# EAGLE design Keyboard (EAGLE 7.2.0)
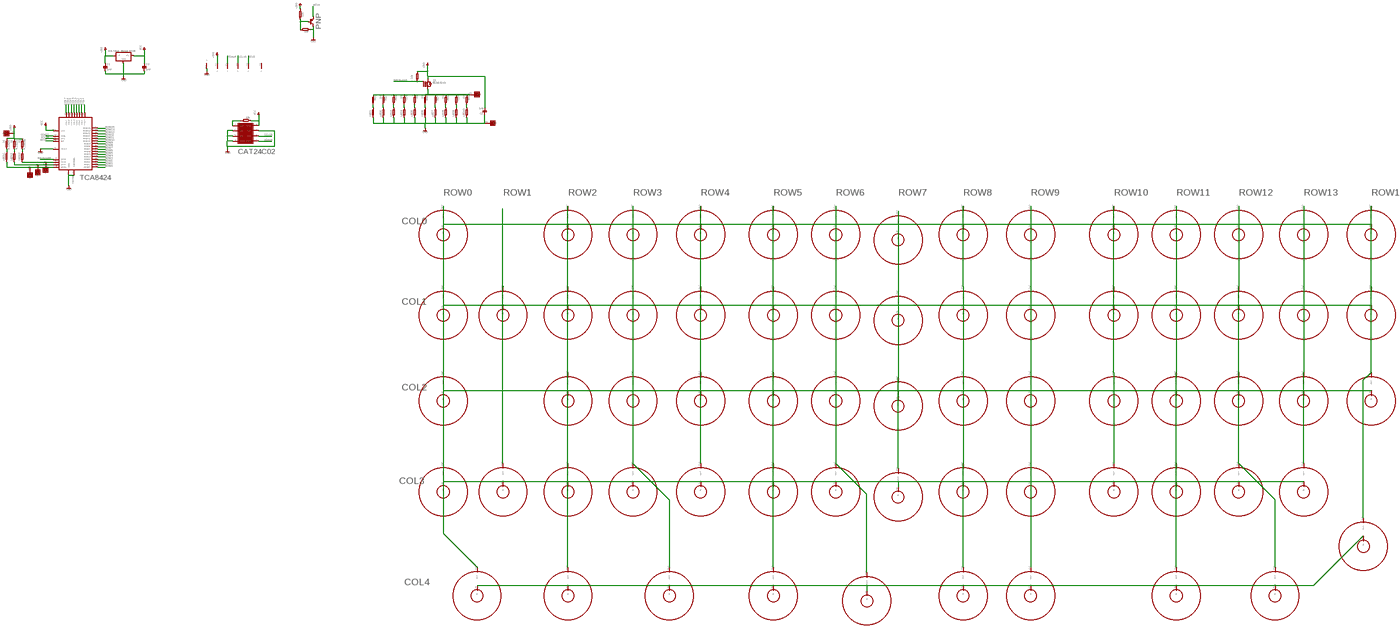
[diagram p0: schematic, sheet 1, overview]
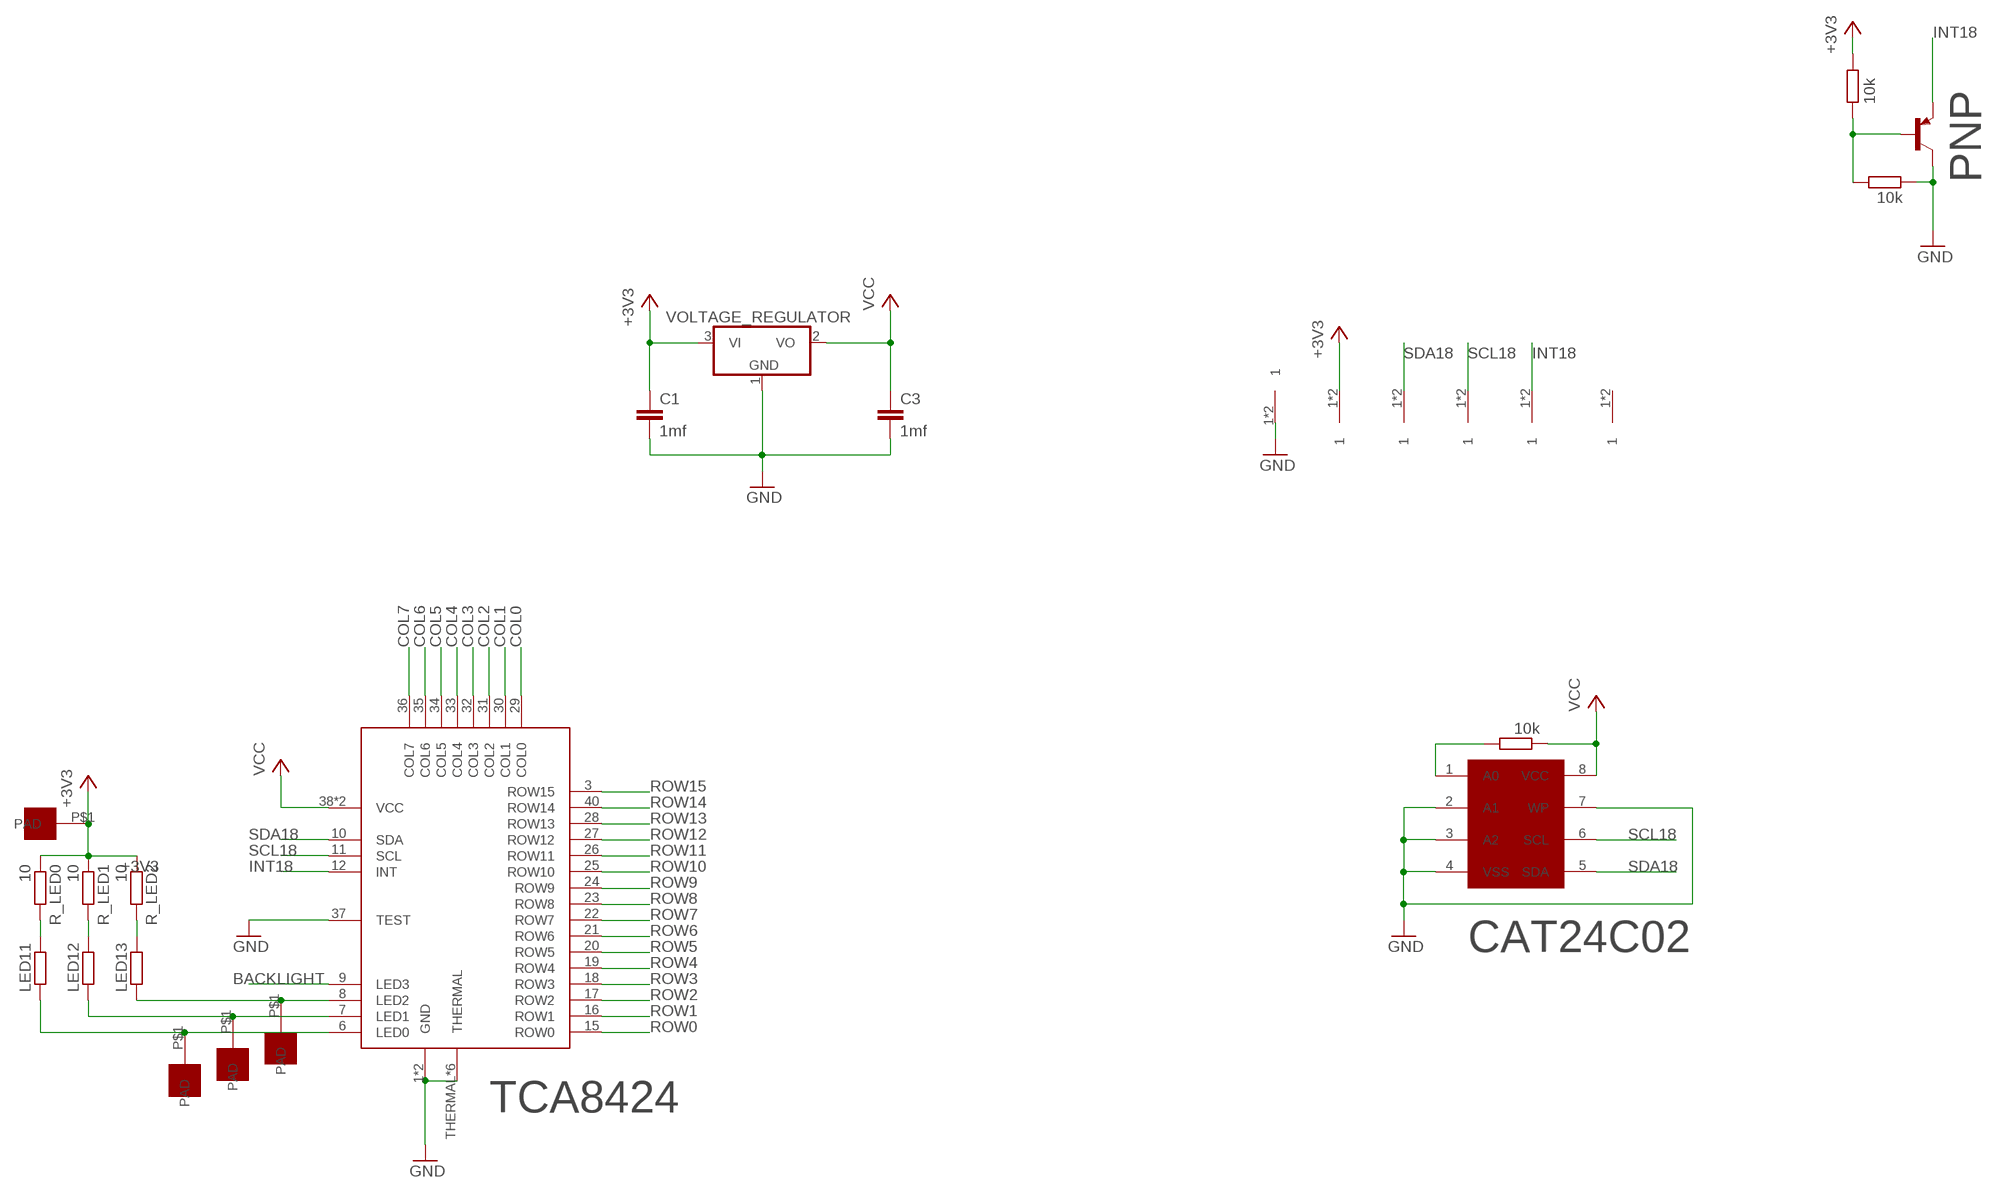
[diagram p1: schematic, sheet 1, part 1 of 5]
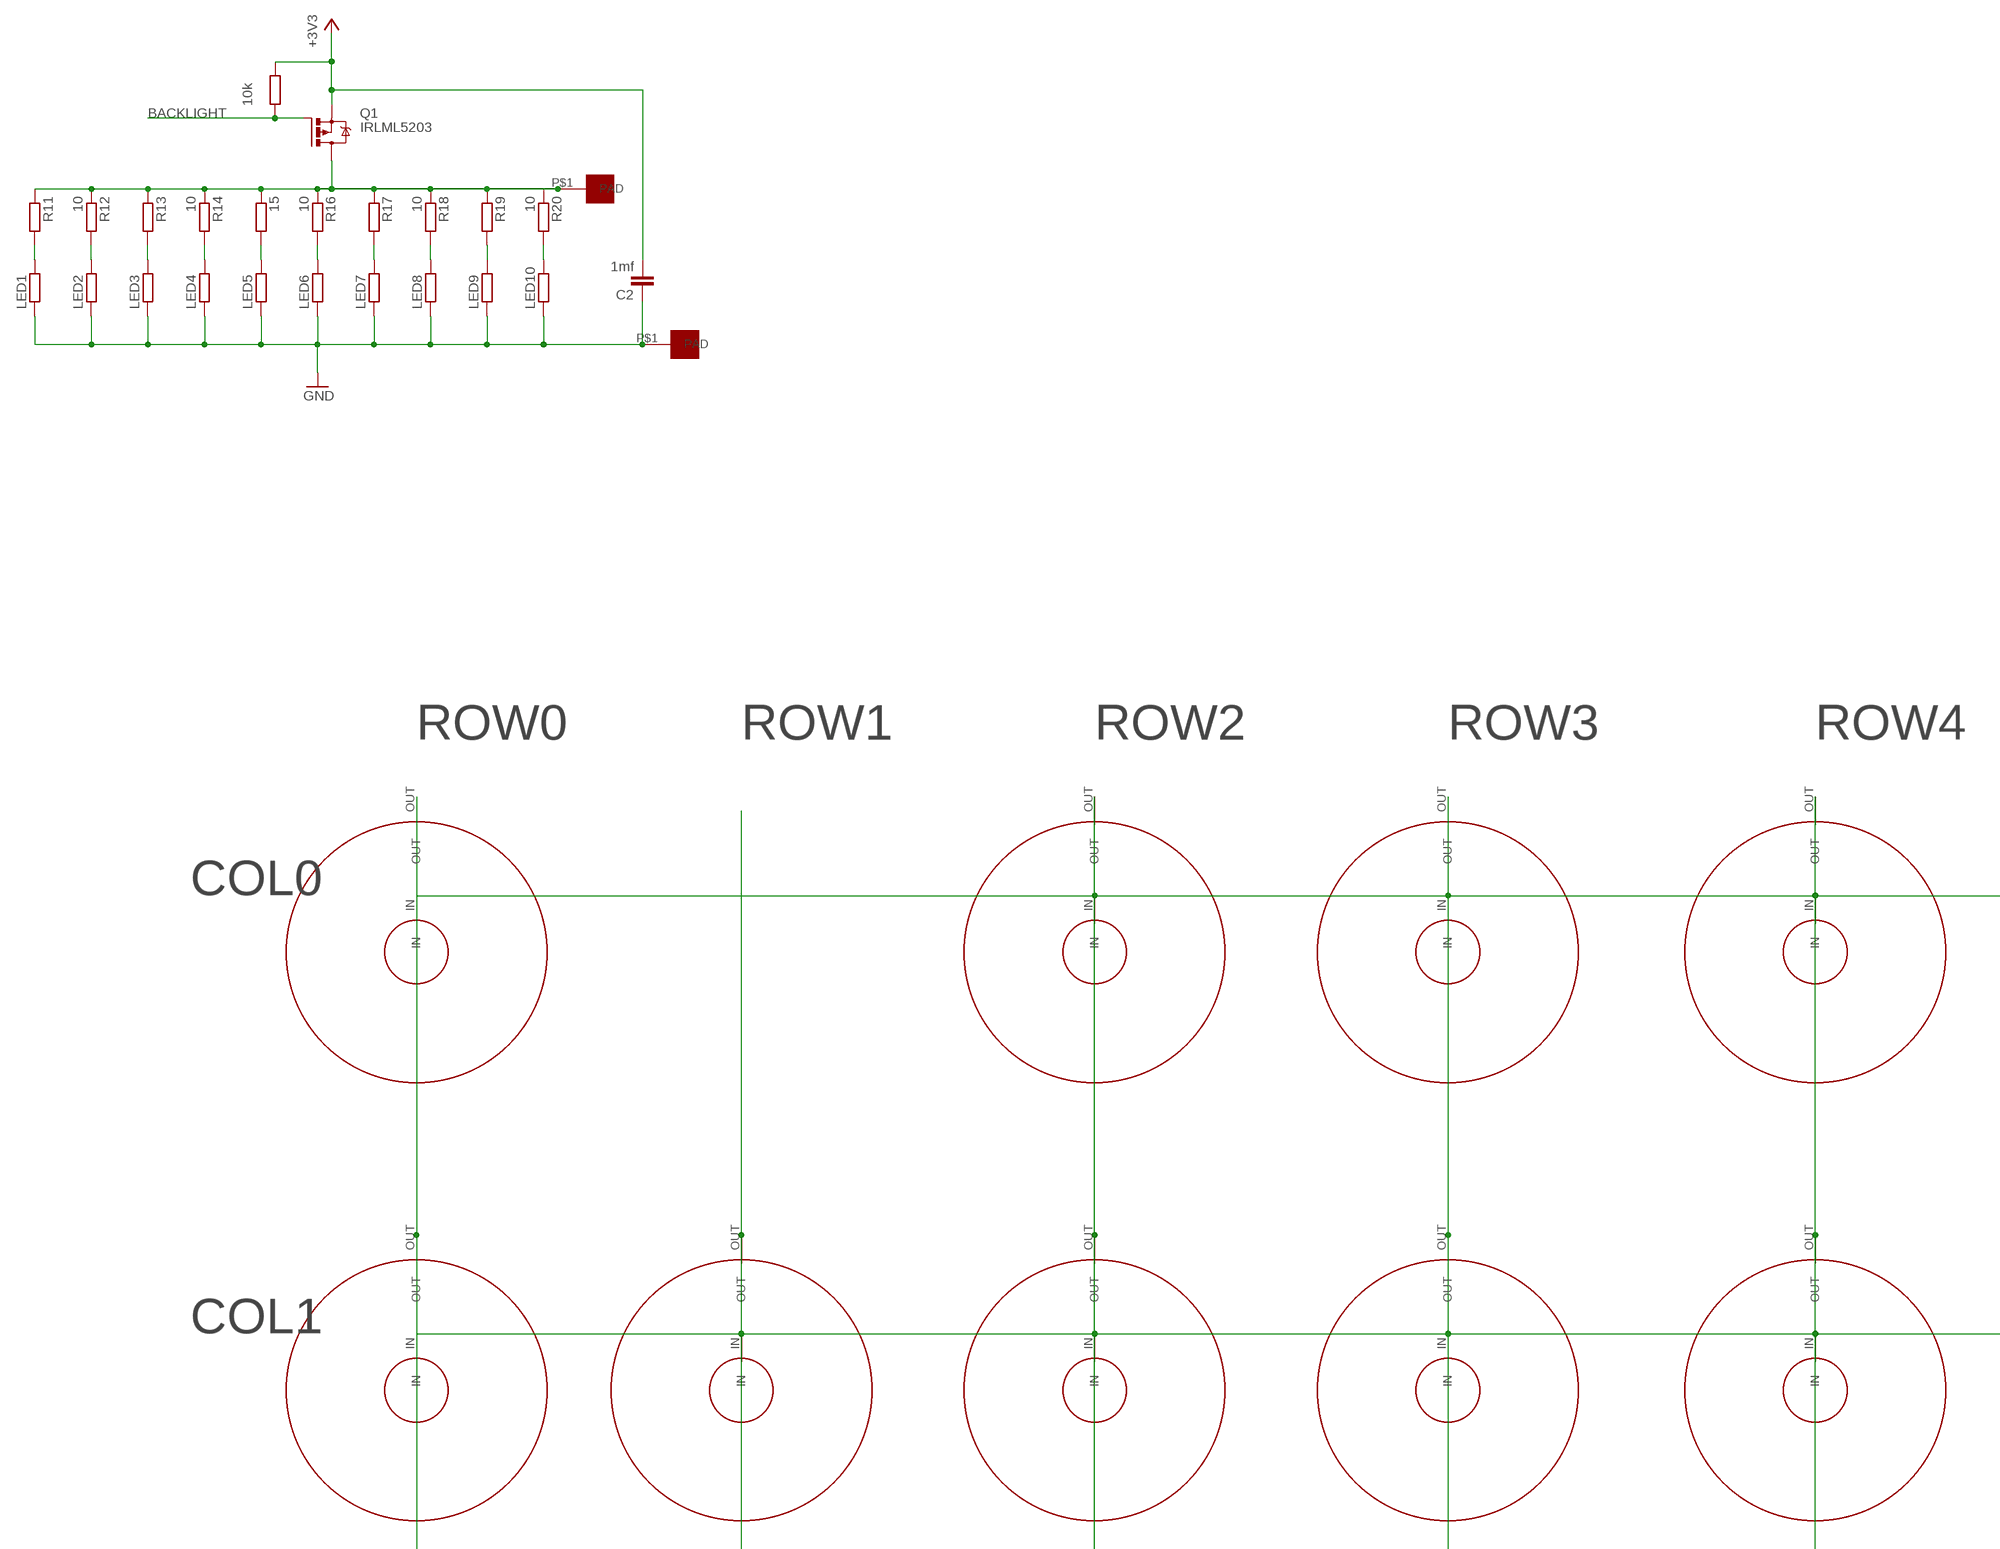
[diagram p2: schematic, sheet 1, part 2 of 5]
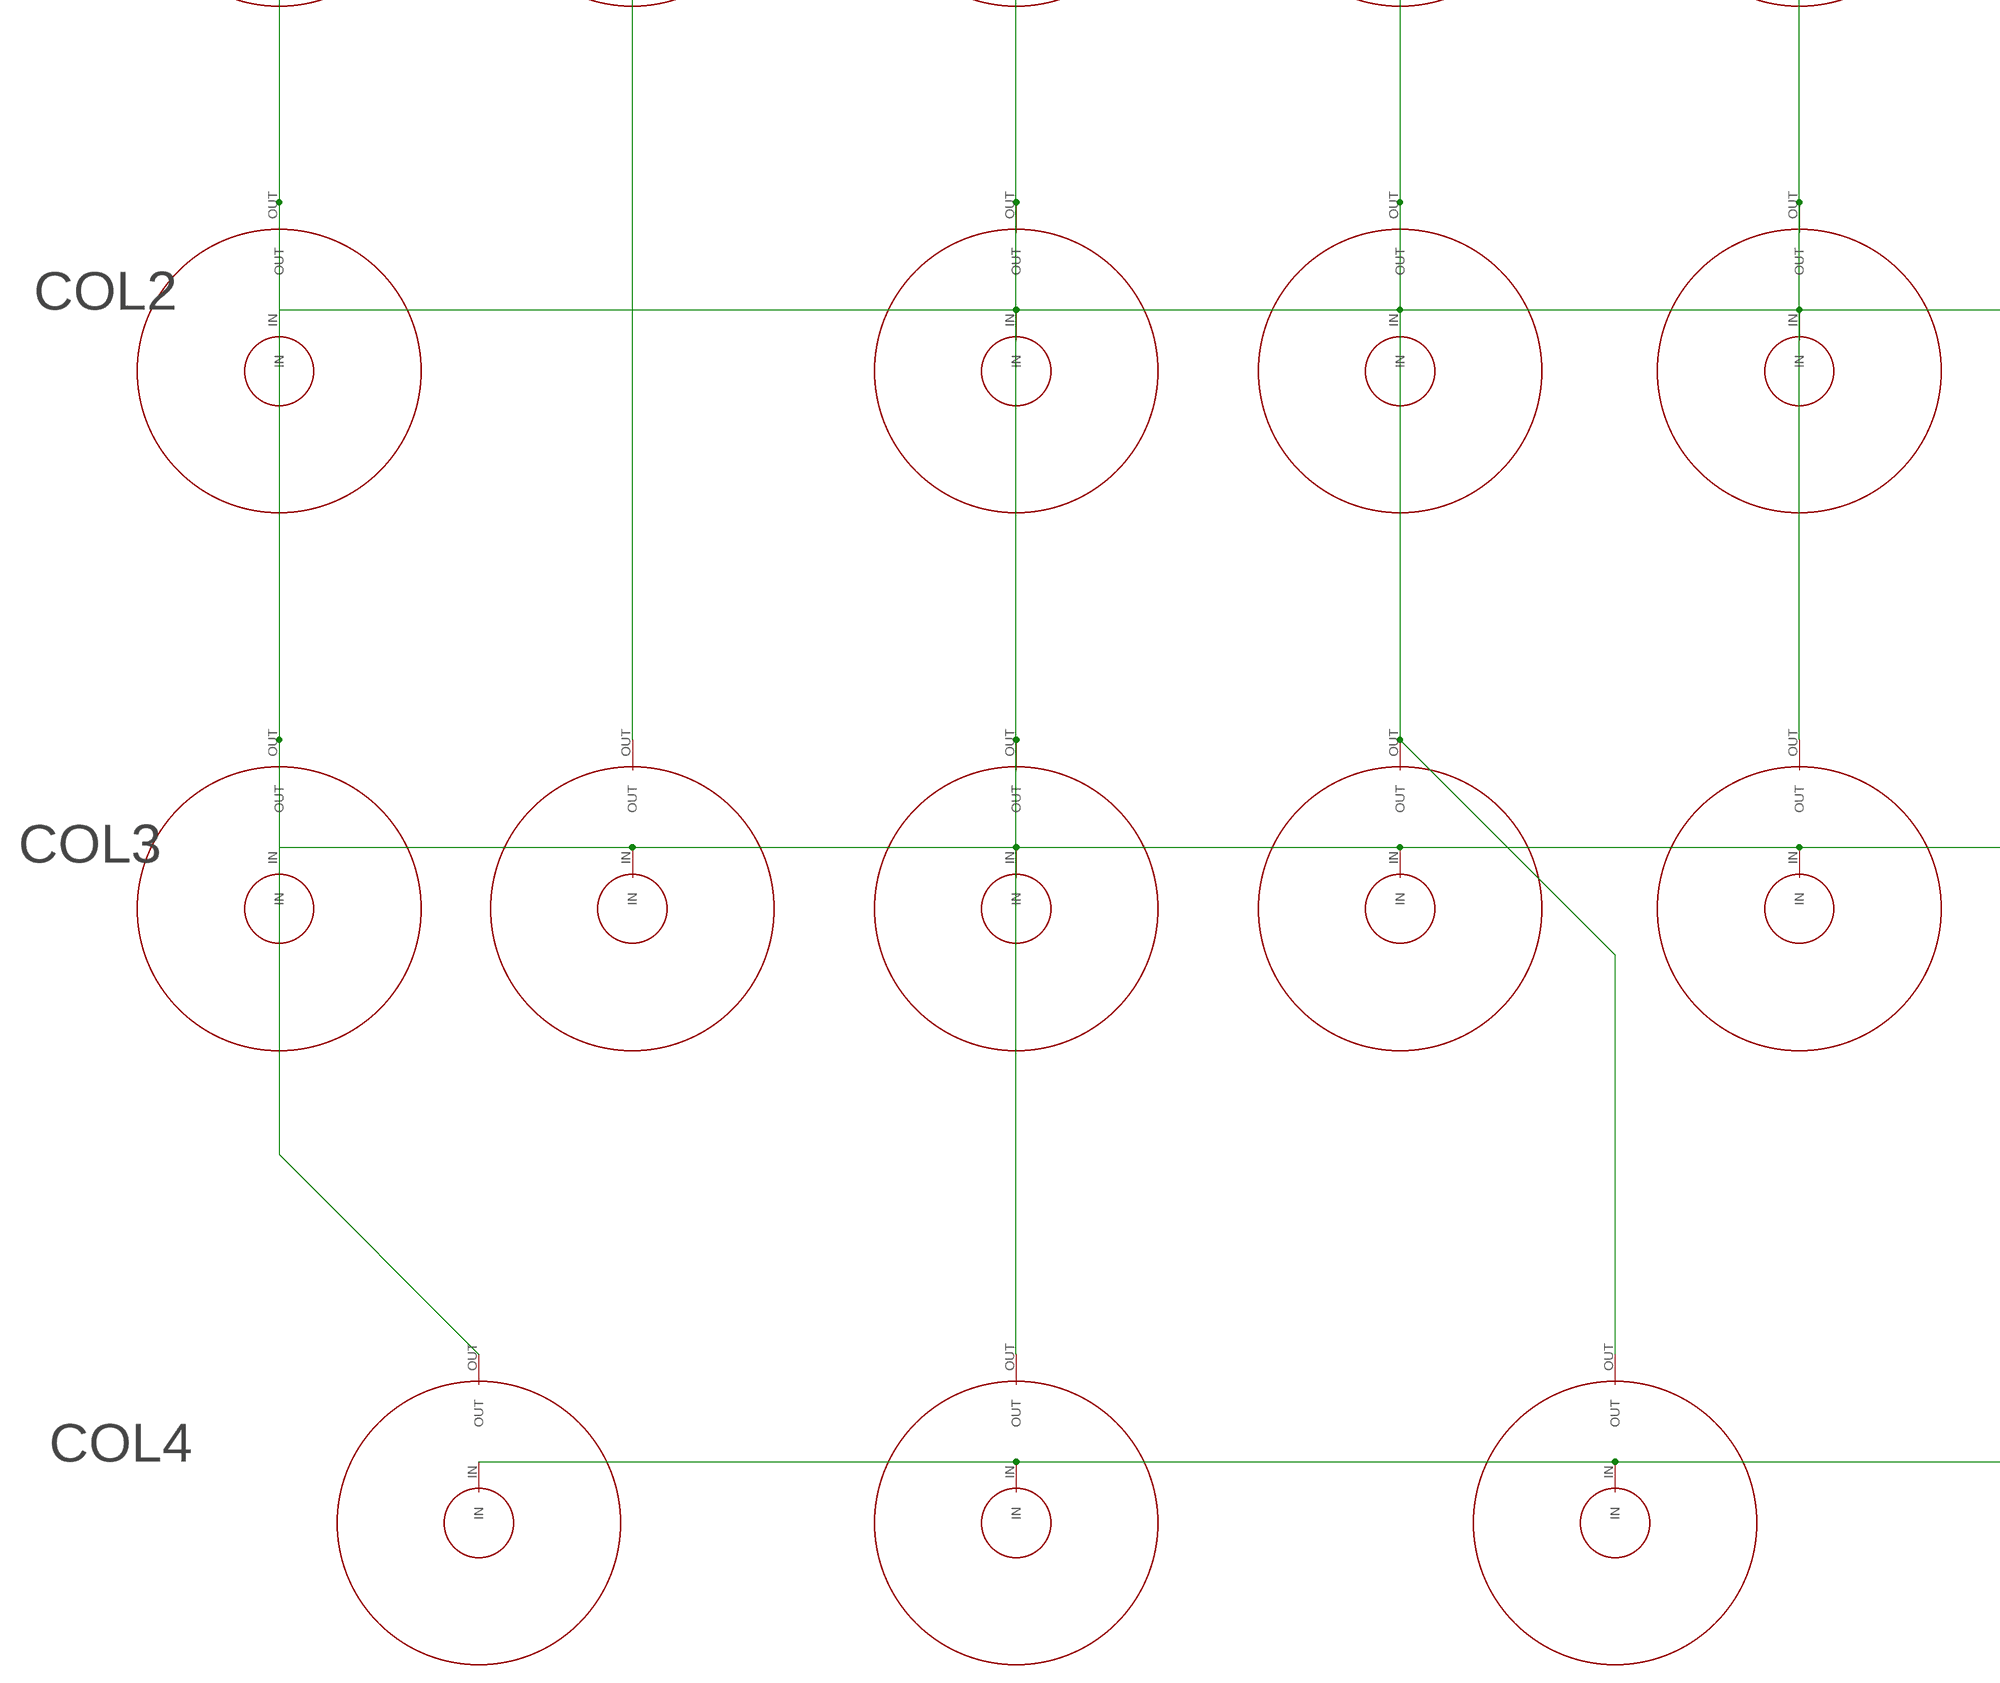
[diagram p3: schematic, sheet 1, part 3 of 5]
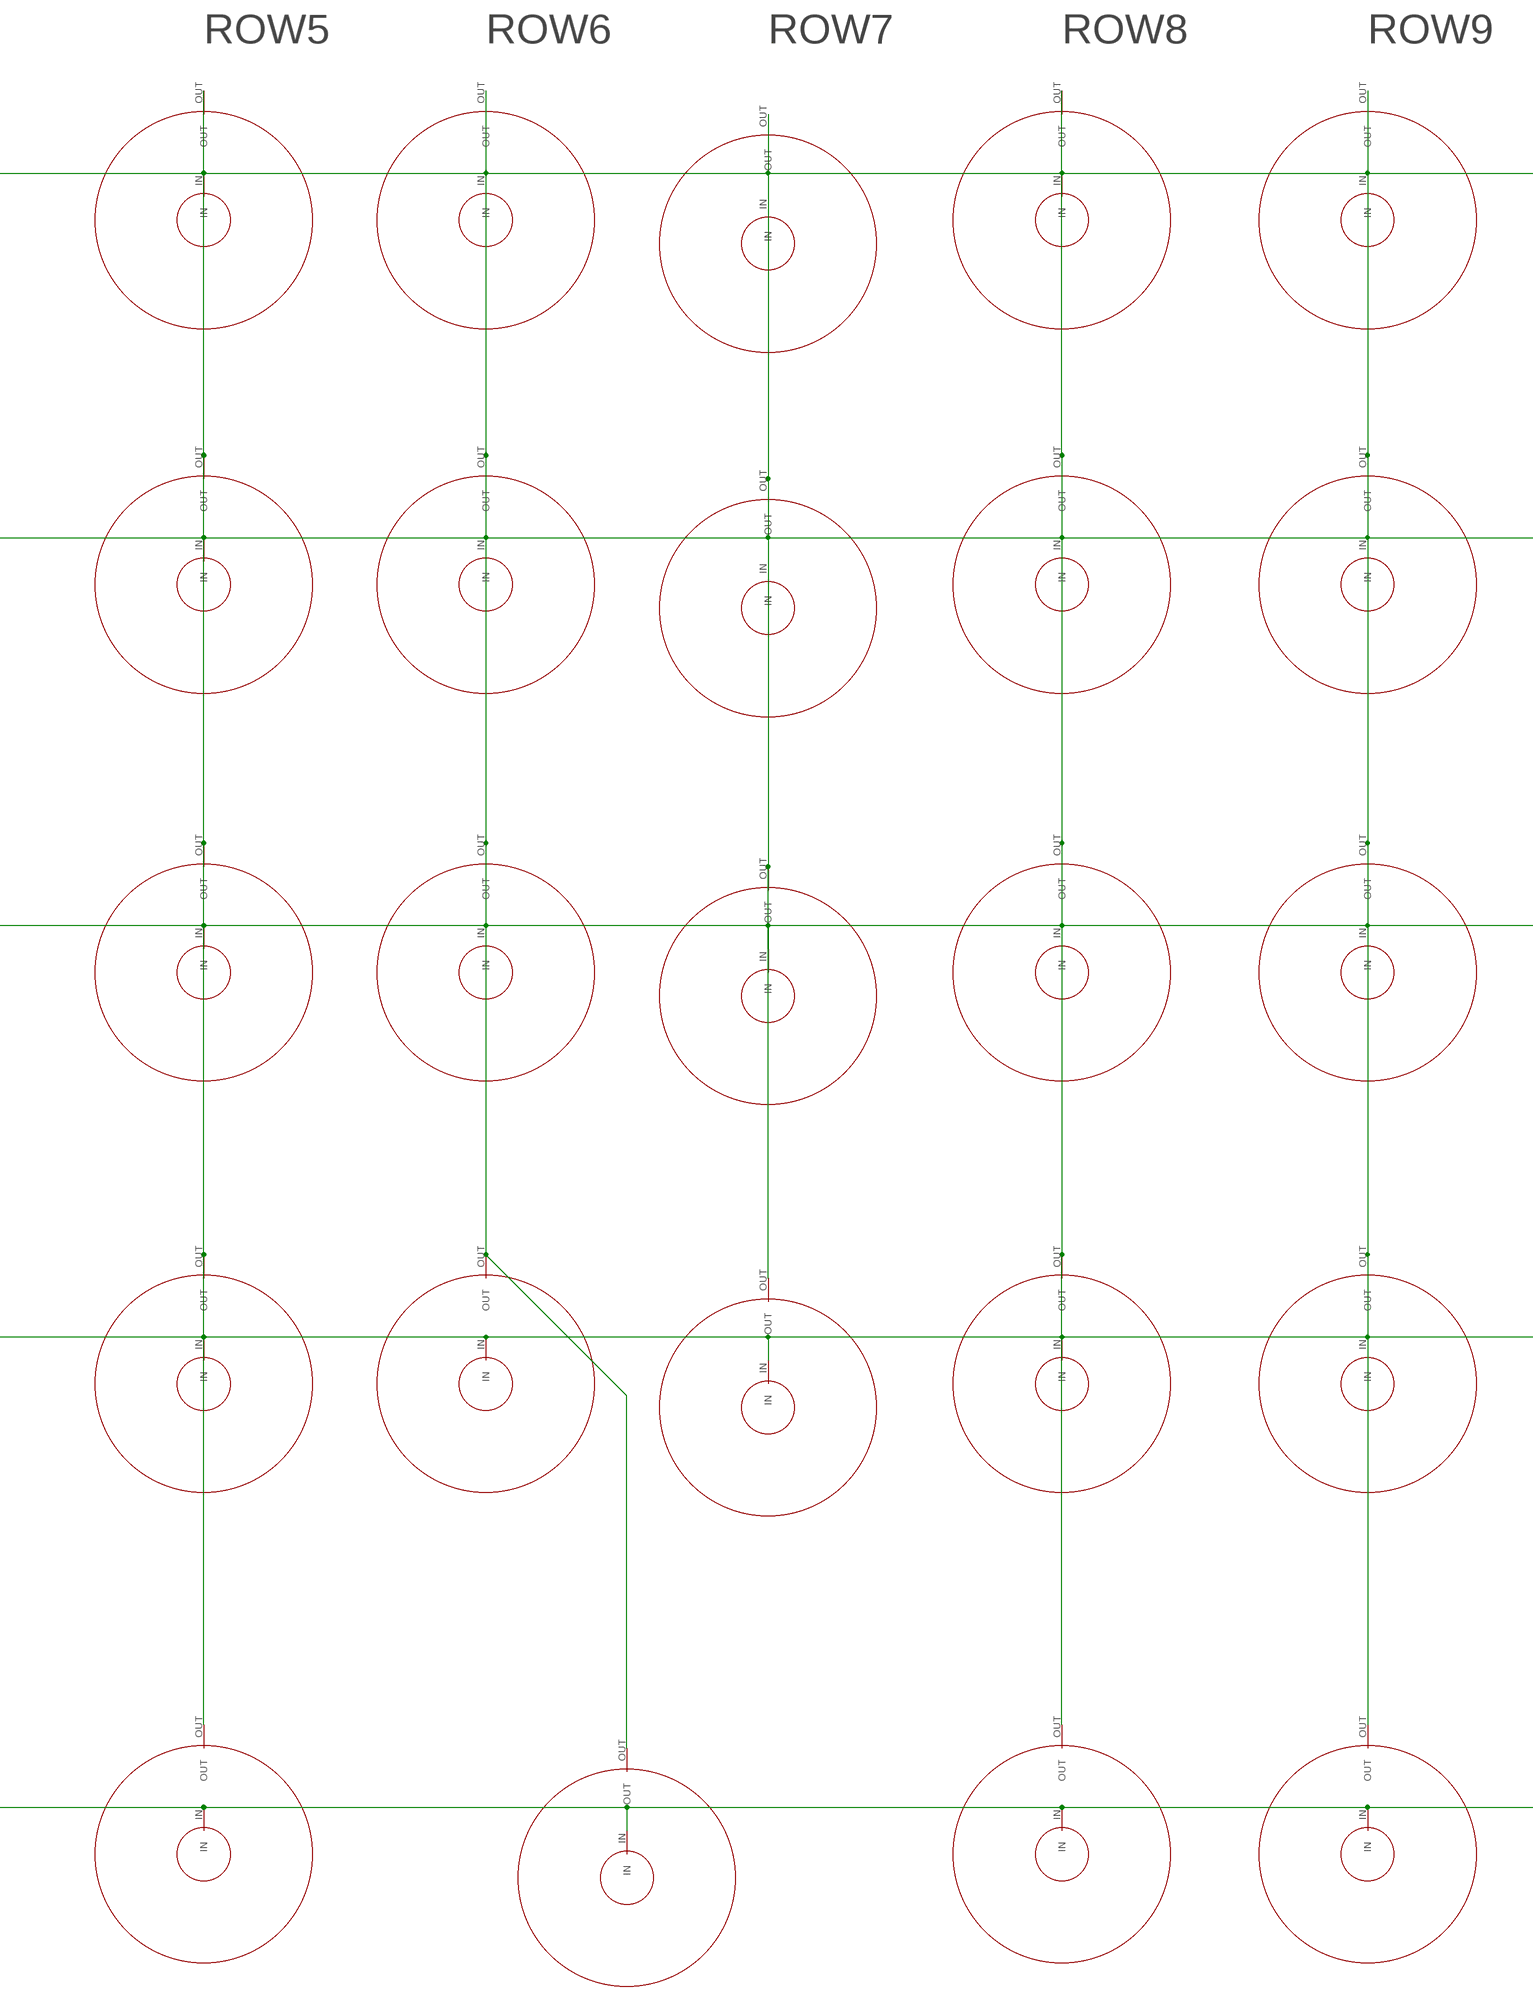
[diagram p4: schematic, sheet 1, part 4 of 5]
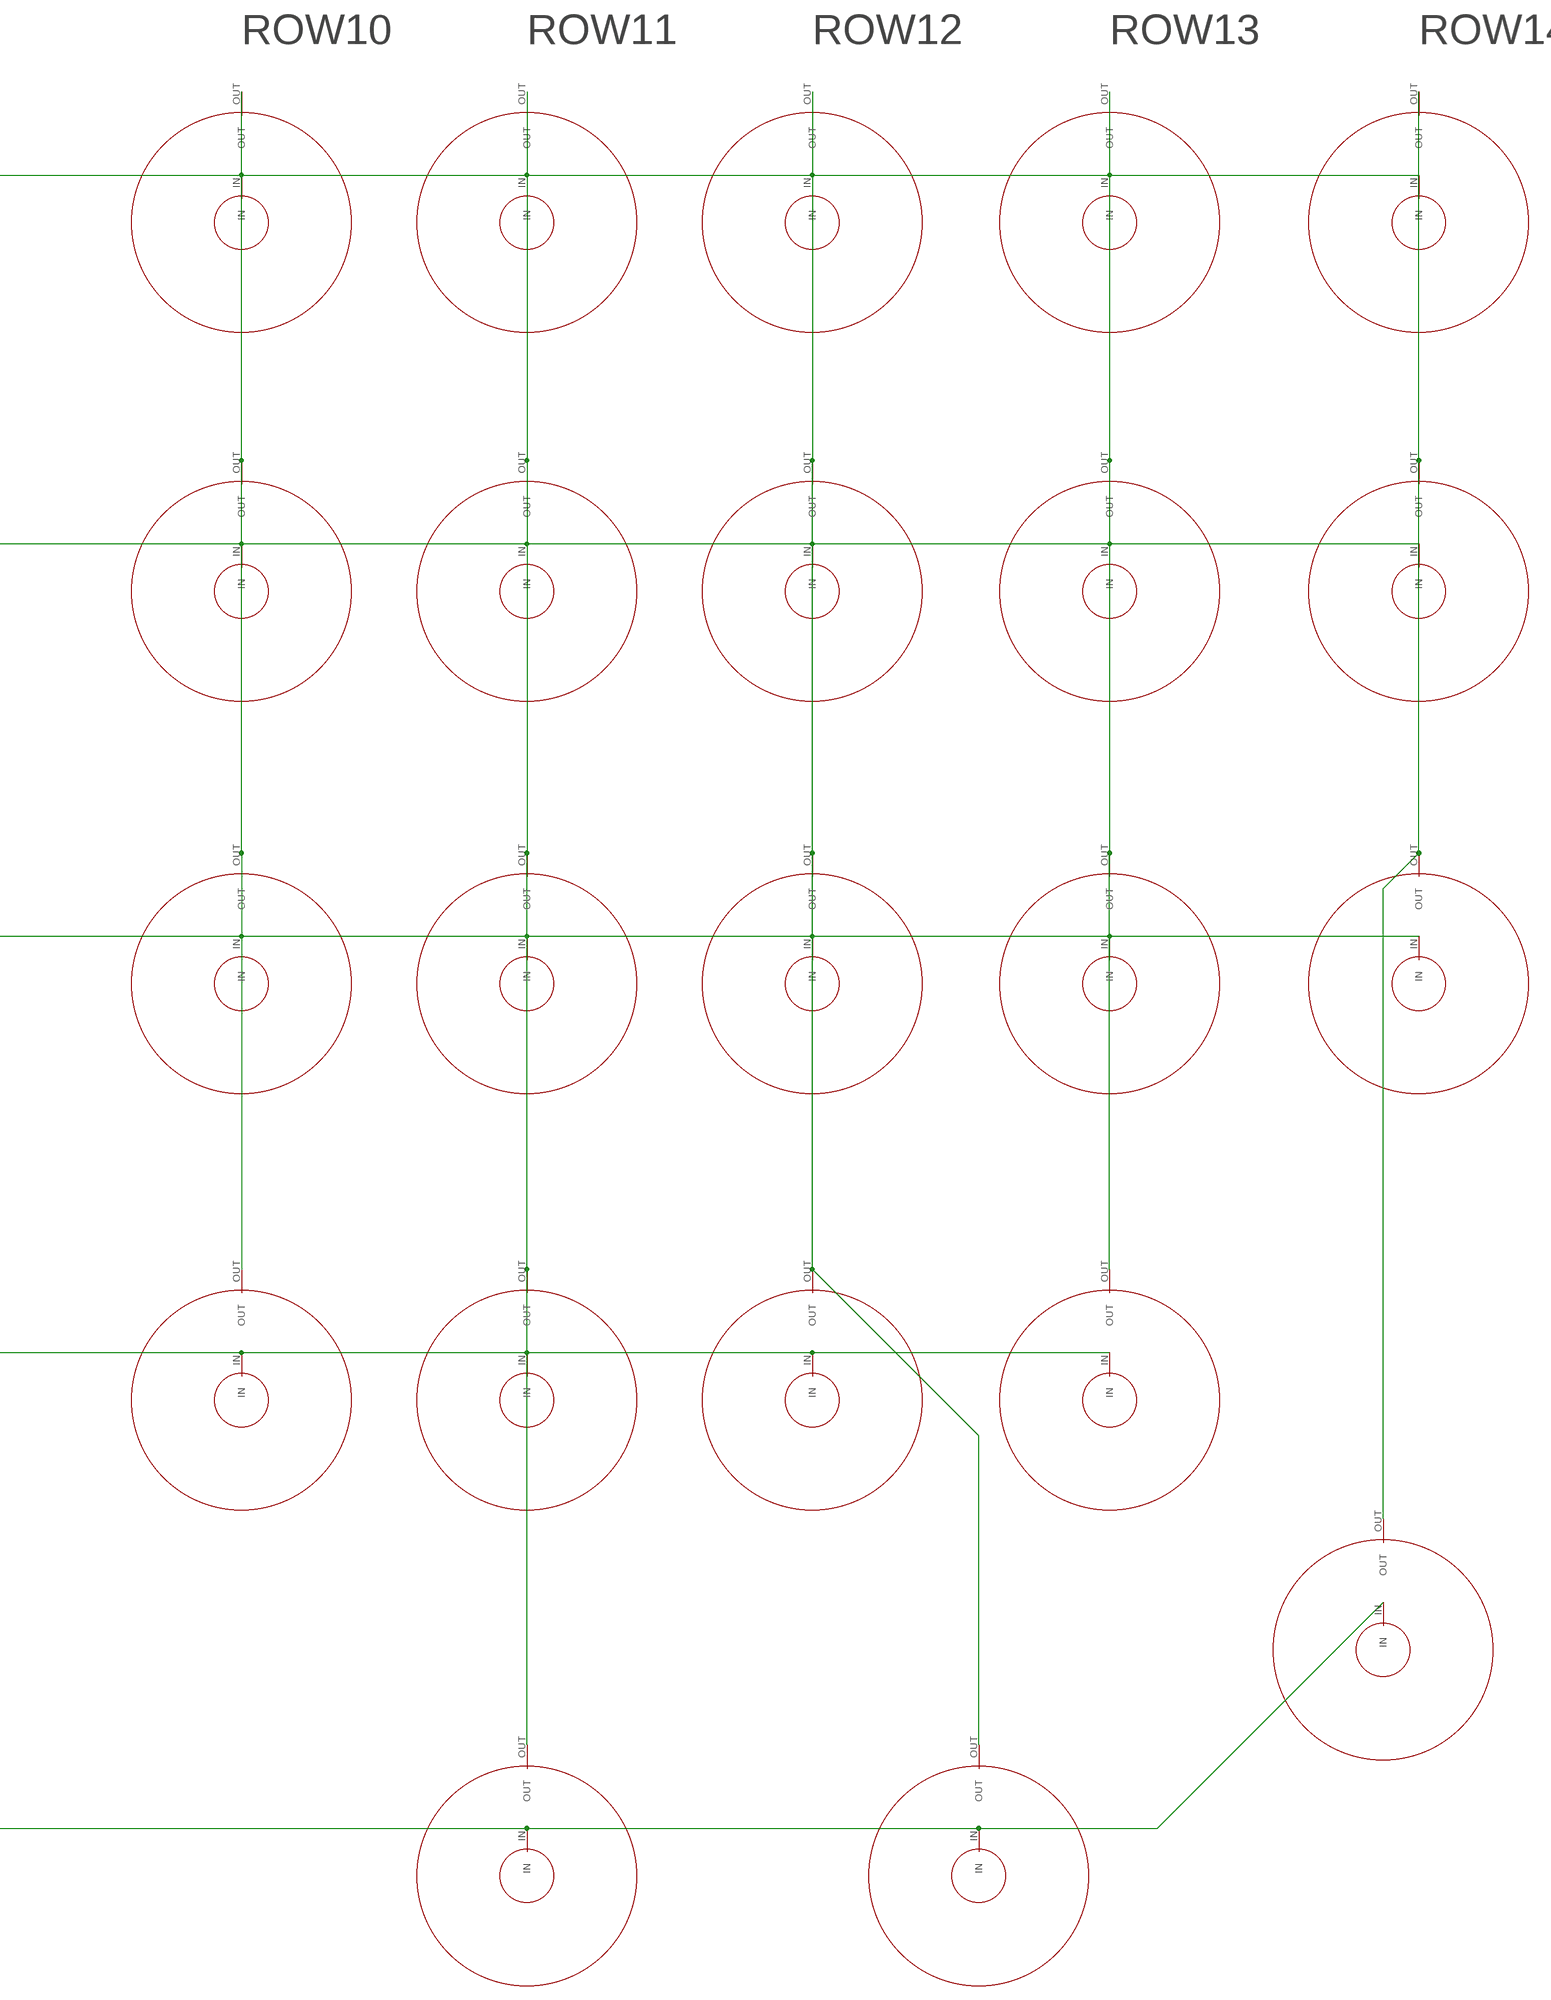
[diagram p5: schematic, sheet 1, part 5 of 5]

## Parts
15  R-EU_R0603  [R0603]
+  PAD  [PAD]
BL_PULLUP  10k  R-EU_R0603  [R0603]
C1  1mf  C-EUC0603  [C0603]
C2  1mf  C-EUC0603  [C0603]
C3  1mf  C-EUC0603  [C0603]
LED1  R-EU_R0402  [R0402]
LED2  R-EU_R0402  [R0402]
LED3  R-EU_R0402  [R0402]
LED4  R-EU_R0402  [R0402]
LED5  R-EU_R0402  [R0402]
LED6  R-EU_R0402  [R0402]
LED7  R-EU_R0402  [R0402]
LED8  R-EU_R0402  [R0402]
LED9  R-EU_R0402  [R0402]
LED10  R-EU_R0402  [R0402]
LED11  R-EU_R0402  [R0402]
LED12  R-EU_R0402  [R0402]
LED13  R-EU_R0402  [R0402]
PNP_DOWN  10k  R-EU_R0603  [R0603]
PNP_DOWN1  10k  R-EU_R0603  [R0603]
PNP_UP  10k  R-EU_R0603  [R0603]
Q1  IRLML5203  [MICRO3]
Q2  MMBTA56-SOT23  [SOT23]
R11  R-EU_R0603  [R0603]
R12  10  R-EU_R0603  [R0603]
R13  R-EU_R0603  [R0603]
R14  10  R-EU_R0603  [R0603]
R16  10  R-EU_R0603  [R0603]
R17  R-EU_R0603  [R0603]
R18  10  R-EU_R0603  [R0603]
R19  R-EU_R0603  [R0603]
R20  10  R-EU_R0603  [R0603]
R_LED0  10  R-EU_R0603  [R0603]
R_LED1  10  R-EU_R0603  [R0603]
R_LED2  10  R-EU_R0603  [R0603]
U$1  CAT24  [CAT24]
U$2  TCA8424  [QFN40]
U$3  BOTTOM_POGO  [POGO]
U$4  BOTTOM_POGO  [POGO]
U$5  BOTTOM_POGO  [POGO]
U$6  BOTTOM_POGO  [POGO]
U$7  BOTTOM_POGO  [POGO]
U$8  BOTTOM_POGO  [POGO]
U$9  DOME  [4MM]
U$11  DOME  [4MM]
U$12  DOME  [4MM]
U$13  DOME  [4MM]
U$14  DOME  [4MM]
U$15  DOME  [4MM]
U$16  DOME  [4MM]
U$17  DOME  [4MM]
U$18  DOME  [4MM]
U$19  DOME  [4MM]
U$20  DOME  [4MM]
U$21  DOME  [4MM]
U$22  DOME  [4MM]
U$23  DOME  [4MM]
U$24  DOME  [4MM]
U$25  DOME  [4MM]
U$26  DOME  [4MM]
U$27  DOME  [4MM]
U$28  DOME  [4MM]
U$29  DOME  [4MM]
U$30  DOME  [4MM]
U$31  DOME  [4MM]
U$32  DOME  [4MM]
U$33  DOME  [4MM]
U$34  DOME  [4MM]
U$35  DOME  [4MM]
U$36  DOME  [4MM]
U$37  DOME  [4MM]
U$38  DOME  [4MM]
U$39  DOME  [4MM]
U$40  DOME  [4MM]
U$41  DOME  [4MM]
U$42  DOME  [4MM]
U$43  DOME  [4MM]
U$44  DOME  [4MM]
U$45  DOME  [4MM]
U$46  DOME  [4MM]
U$47  DOME  [4MM]
U$48  DOME  [4MM]
U$49  DOME  [4MM]
U$50  DOME  [4MM]
U$51  DOME  [4MM]
U$52  DOME  [4MM]
U$53  PAD  [PAD]
U$54  DOME  [4MM]
U$55  DOME  [4MM]
U$56  DOME  [4MM]
U$57  DOME  [4MM]
U$58  DOME  [4MM]
U$59  DOME  [4MM]
U$60  DOME  [4MM]
U$61  DOME  [4MM]
U$62  DOME  [4MM]
U$63  DOME  [4MM]
U$64  DOME  [4MM]
U$65  DOME  [4MM]
U$66  DOME  [4MM]
U$67  DOME  [4MM]
U$68  DOME  [4MM]
U$69  DOME  [4MM]
U$70  DOME  [4MM]
U$71  PAD  [PAD]
U$72  DOME  [4MM]
U$73  DOME  [4MM]
U$74  PAD  [PAD]
U$75  DOME  [4MM]
U$76  DOME  [4MM]
U$77  DOME  [4MM]
U$78  PAD  [PAD]
U$79  DOME  [4MM]
U$80  PAD  [PAD]
U$81  DOME  [4MM]
VOLTAGE_REGULATOR  MCP1703CB  [SOT23]

## Nets
+3V3: +.P$1(PAD) BL_PULLUP.1 C1.1 C2.2 PNP_UP.1 Q1.2(S) R_LED0.1 R_LED1.1 R_LED2.1 U$4.1 U$4.P$2 VOLTAGE_REGULATOR.3(VI)
BACKLIGHT: BL_PULLUP.2 Q1.1(G) U$2.9(LED3)
COL0: U$2.29(COL0) U$9.IN U$11.IN U$12.IN U$13.IN U$14.IN U$15.IN U$16.IN U$17.IN U$18.IN U$19.IN U$20.IN U$21.IN U$22.IN U$23.IN
COL1: U$2.30(COL1) U$24.IN U$25.IN U$26.IN U$27.IN U$28.IN U$29.IN U$30.IN U$31.IN U$32.IN U$33.IN U$34.IN U$35.IN U$36.IN U$37.IN U$38.IN
COL2: U$2.31(COL2) U$39.IN U$40.IN U$41.IN U$42.IN U$43.IN U$44.IN U$45.IN U$46.IN U$47.IN U$48.IN U$49.IN U$50.IN U$51.IN U$52.IN
COL3: U$2.32(COL3) U$54.IN U$55.IN U$56.IN U$57.IN U$58.IN U$59.IN U$60.IN U$61.IN U$62.IN U$63.IN U$64.IN U$65.IN U$66.IN U$68.IN
COL4: U$2.33(COL4) U$67.IN U$69.IN U$70.IN U$72.IN U$73.IN U$75.IN U$76.IN U$77.IN U$79.IN U$81.IN
COL5: U$2.34(COL5)
COL6: U$2.35(COL6)
COL7: U$2.36(COL7)
DRAIN: 15.1 Q1.3(D) R11.1 R12.1 R13.1 R14.1 R16.1 R17.1 R18.1 R19.1 R20.1 U$78.P$1(PAD)
GND: C1.2 C2.1 C3.2 LED1.1 LED2.1 LED3.1 LED4.1 LED5.1 LED6.1 LED7.1 LED8.1 LED9.1 LED10.1 PNP_DOWN.2 Q2.3(C) U$1.2(A1) U$1.3(A2) U$1.4(VSS) U$1.7(WP) U$2.1(GND) U$2.4(GND) U$2.37(TEST) U$2.THERMAL U$2.VIA1(THERMAL) U$2.VIA2(THERMAL) U$2.VIA3(THERMAL) U$2.VIA4(THERMAL) U$2.VIA5(THERMAL) U$3.1 U$3.P$2 U$80.P$1(PAD) VOLTAGE_REGULATOR.1(GND)
INT18: Q2.2(E) U$2.12(INT) U$7.1 U$7.P$2
LED_GROUND0: LED11.2 R_LED0.2
LED_GROUND1: LED12.2 R_LED1.2
LED_GROUND2: LED13.2 R_LED2.2
N$1: LED1.2 R11.2
N$2: LED2.2 R12.2
N$3: LED3.2 R13.2
N$4: LED4.2 R14.2
N$6: 15.2 LED5.2
N$7: LED6.2 R16.2
N$8: LED7.2 R17.2
N$9: LED8.2 R18.2
N$10: LED9.2 R19.2
N$11: LED10.2 R20.2
N$13: PNP_DOWN.1 PNP_UP.2 Q2.1(B)
N$14: LED12.1 U$2.7(LED1) U$71.P$1(PAD)
N$15: LED11.1 U$2.6(LED0) U$53.P$1(PAD)
N$16: LED13.1 U$2.8(LED2) U$74.P$1(PAD)
N$17: PNP_DOWN1.2 U$1.1(A0)
ROW0: U$2.15(ROW0) U$9.OUT U$24.OUT U$39.OUT U$54.OUT U$69.OUT
ROW1: U$2.16(ROW1) U$38.OUT U$68.OUT
ROW2: U$2.17(ROW2) U$11.OUT U$25.OUT U$40.OUT U$55.OUT U$70.OUT
ROW3: U$2.18(ROW3) U$12.OUT U$26.OUT U$41.OUT U$56.OUT U$72.OUT
ROW4: U$2.19(ROW4) U$13.OUT U$27.OUT U$42.OUT U$57.OUT
ROW5: U$2.20(ROW5) U$14.OUT U$28.OUT U$43.OUT U$58.OUT U$73.OUT
ROW6: U$2.21(ROW6) U$15.OUT U$29.OUT U$44.OUT U$59.OUT U$75.OUT
ROW7: U$2.22(ROW7) U$16.OUT U$30.OUT U$45.OUT U$60.OUT
ROW8: U$2.23(ROW8) U$17.OUT U$31.OUT U$46.OUT U$61.OUT U$76.OUT
ROW9: U$2.24(ROW9) U$18.OUT U$32.OUT U$47.OUT U$62.OUT U$77.OUT
ROW10: U$2.25(ROW10) U$19.OUT U$33.OUT U$48.OUT U$63.OUT
ROW11: U$2.26(ROW11) U$20.OUT U$34.OUT U$49.OUT U$64.OUT U$79.OUT
ROW12: U$2.27(ROW12) U$21.OUT U$35.OUT U$50.OUT U$65.OUT U$81.OUT
ROW13: U$2.28(ROW13) U$22.OUT U$36.OUT U$51.OUT U$66.OUT
ROW14: U$2.40(ROW14) U$23.OUT U$37.OUT U$52.OUT U$67.OUT
ROW15: U$2.3(ROW15)
SCL18: U$1.6(SCL) U$2.11(SCL) U$6.1 U$6.P$2
SDA18: U$1.5(SDA) U$2.10(SDA) U$5.1 U$5.P$2
VCC: C3.1 PNP_DOWN1.1 U$1.8(VCC) U$2.38(VCC) U$2.39(VCC) VOLTAGE_REGULATOR.2(VO)
Unconnected: U$8.1 U$8.P$2

## Notes on the sheet
- PNP
- CAT24C02
- TCA8424

## Library data of the parts
15 BL_PULLUP LED1-LED13 PNP_DOWN PNP_DOWN1 PNP_UP R11-R14 R16-R20 R_LED0 R_LED1 R_LED2 = rcl:R-EU_: RESISTOR, European symbol
+ U$53 U$71 U$74 U$78 U$80 = PAD:PAD
C1-C3 = rcl:C-EU: CAPACITOR, European symbol
Q1 = transistor-power:IRLML5203: HEXFET P-Channel Power MOSFET
Q2 = transistor-pnp:*-?: PNP Transistor
U$1 = cat24:CAT24
U$2 = TCA8424:TCA8424
U$3-U$8 = bottom_pogo:BOTTOM_POGO
U$9 U$11-U$52 U$54-U$70 U$72 U$73 U$75-U$77 U$79 U$81 = DOME:DOME
VOLTAGE_REGULATOR = linear:MCP1703: 250 mA, 16V, Low Quiescent Current LDO Regulator Source: http://ww1.microchip.com/downloads/en/DeviceDoc/22049b.pdf

## Board
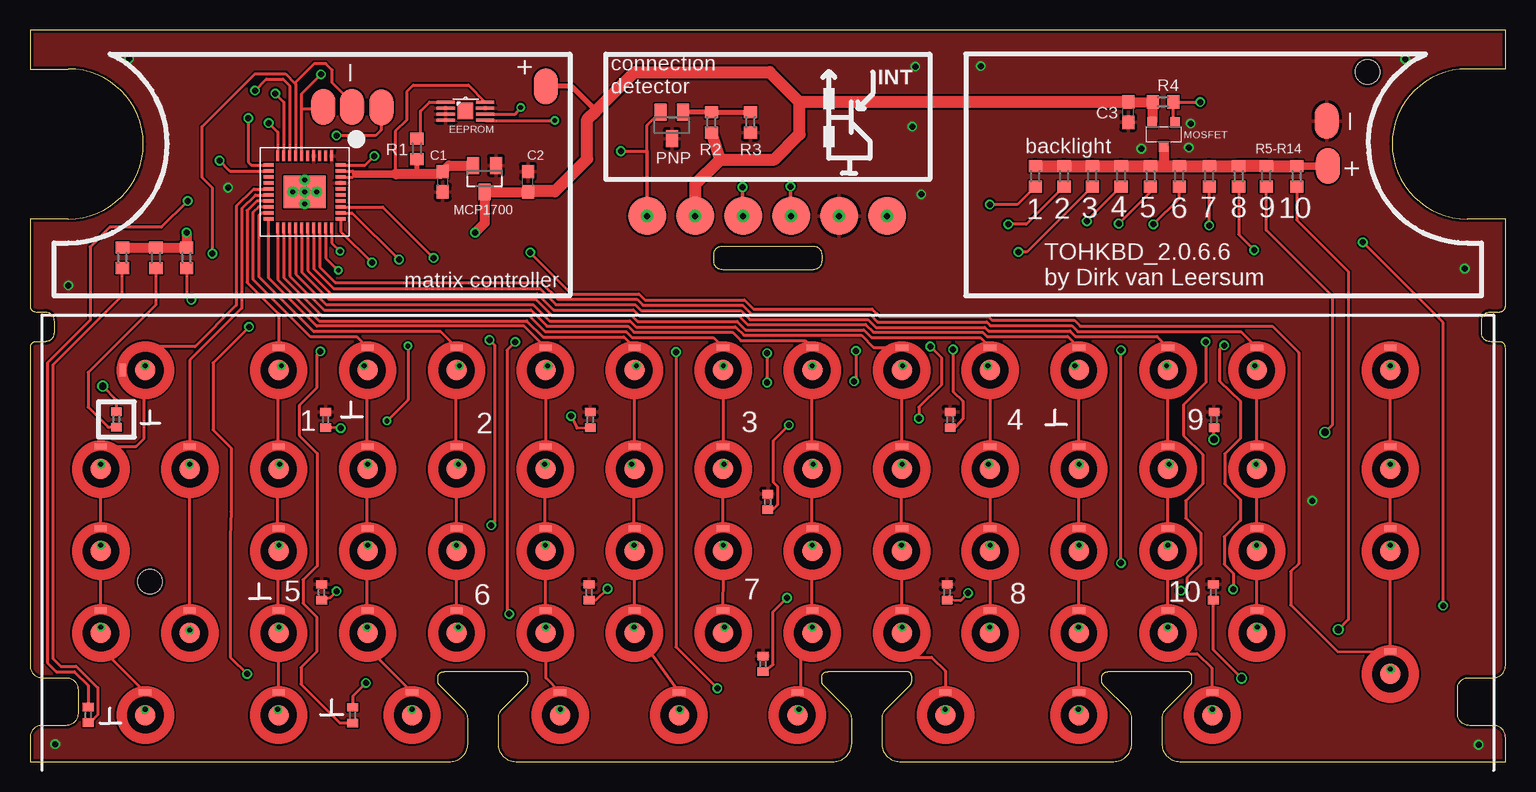
[diagram p6: board, top side]
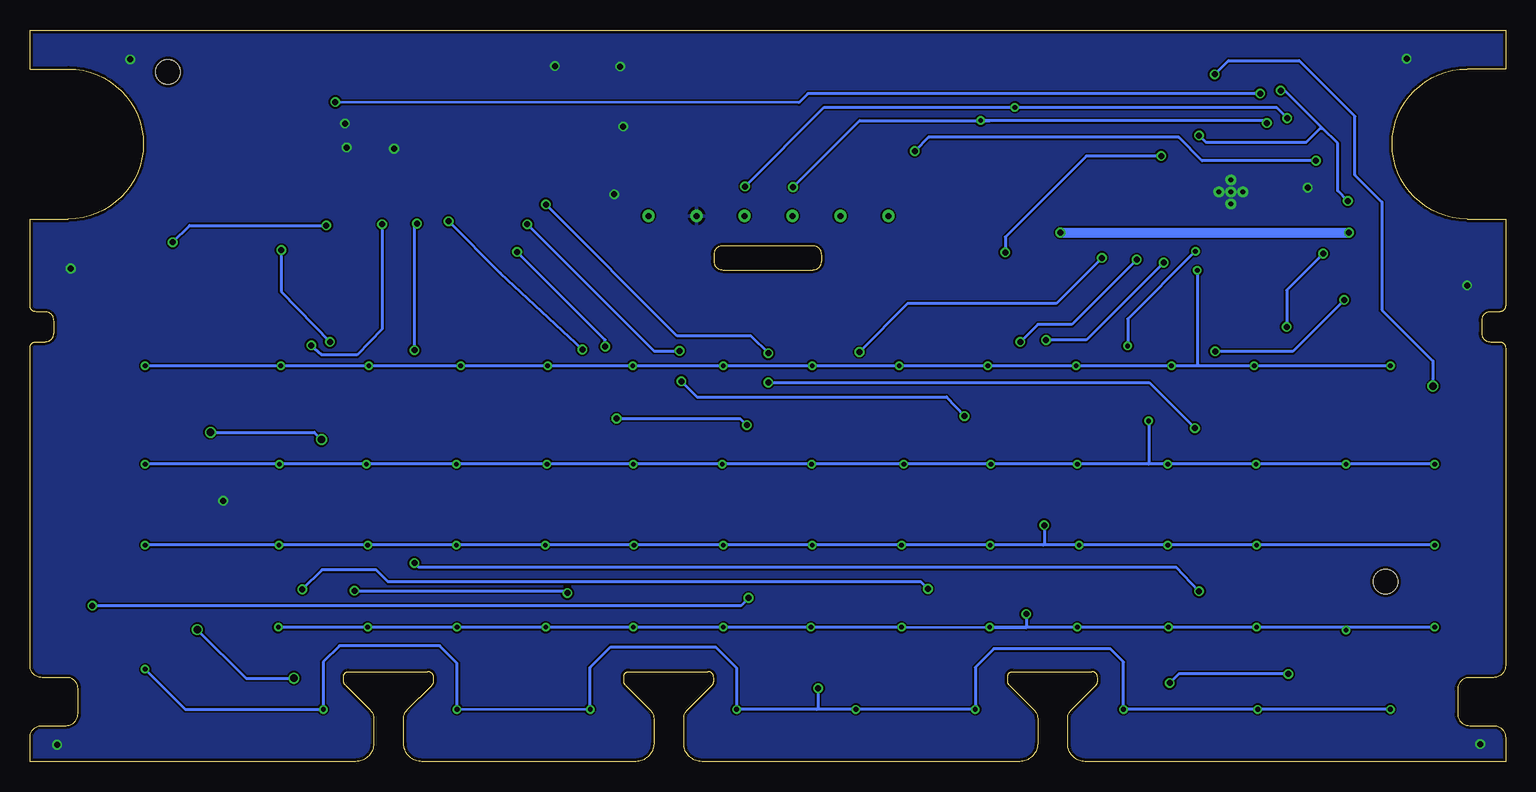
[diagram p7: board, bottom side, seen from below]

Size 123 x 61 mm. Coordinates in mm from the lower left corner, seen from the top.
Outline: 123,0 123,2 arc90 122,3 120,3 arc-90 119,4 119,6.1 arc-90 119.9,7 122,7 arc90 123,8 123,34.5 arc90 122.5,35 121.75,35 arc-90 121,35.75 121,36.75 arc-90 121.75,37.5 122.5,37.5 arc90 123,38 123,45.25 119.8,45.25 arc-180 119.8,57.75 123,57.75 123,61 0,61 0,57.75 3.2,57.75 arc-180 3.2,45.25 0,45.25 0,38 arc90 0.5,37.5 1.25,37.5 arc-90 2,36.75 2,35.75 arc-90 1.25,35 0.5,35 arc90 0,34.5 0,8 arc90 1,7 3,7 arc-90 4,6 4,4 arc-90 3,3 1,3 arc90 0,2 0,0 35.05,0 arc90 36.5,1.45 36.5,3.59 arc45 36.21,4.29 34.15,6.35 arc-45 34,6.71 34,7 arc-90 34.5,7.5 41.1,7.5 arc-90 41.5,7.1 41.5,6.71 arc-45 41.35,6.35 39.29,4.29 arc45 39,3.59 39,1.5 arc90 40.5,0 67,0 arc90 68.5,1.5 68.5,3.59 arc45 68.21,4.29 66.15,6.35 arc-45 66,6.71 66,7 arc-90 66.5,7.5 73.1,7.5 arc-90 73.5,7.1 73.5,6.71 arc-45 73.35,6.35 71.29,4.29 arc45 71,3.59 71,1.5 arc90 72.5,0 90.35,0 arc90 91.85,1.5 91.85,3.59 arc45 91.56,4.29 89.5,6.35 arc-45 89.35,6.71 89.35,7 arc-90 89.85,7.5 96.45,7.5 arc-90 96.85,7.1 96.85,6.71 arc-45 96.7,6.35 94.64,4.29 arc45 94.35,3.59 94.35,1.5 arc90 95.85,0 123,0
Outline: 57.75,43 65.25,43 arc-90 66,42.25 66,41.75 arc-90 65.25,41 57.75,41 arc-90 57,41.75 57,42.25 arc-90 57.75,43
Copper layers (1*16): Top 0.035mm / dielectric 1.5mm / Bottom 0.035mm
Design rules "ITEADstudio_DRC": minimum track width 6mil, minimum drill 12mil, track to track 6mil, track to pad 6mil, pad to pad 6mil, via to via 6mil, smd to smd 0mil, copper to edge 10mil, drill to drill 10mil, minimum pad ring 10mil, minimum via ring 6mil, stop-mask expansion 2mil, vias tented up to drill 100mil, thermal gap 10mil
Holes 2 mm at 10,15 111.5,57.5

### Footprints (pad centres in the part's own frame; a part is rotated, then mirrored left to right if it is on the bottom)
R0603 = smd 1 x 1.1: 1 -0.85,0; 2 0.85,0
PAD = smd 2 x 3: P$1 0,0
C0603 = smd 1.1 x 1: 1 -0.85,0; 2 0.85,0
R0402 = smd 0.7 x 0.9: 1 -0.65,0; 2 0.65,0
MICRO3 = smd 0.8 x 0.9: 1 -0.95,-1; 2 0.95,-1; 3 0,1
SOT23 = smd 1 x 1.4: 1 -0.95,-1.1; 2 0.95,-1.1; 3 0,1.1
CAT24 = smd 0.25 x 1.5: 1 -0.75,-1.65; 2 -0.25,-1.65; 3 0.25,-1.65; 4 0.75,-1.65; 5 0.75,1.65; 6 0.25,1.65; 7 -0.25,1.65; 8 -0.75,1.65 | smd 1.4 x 1.3: P$1 0,0
QFN40 = smd 0.85 x 0.28: 1 -3,2.25; 2 -3,1.75; 3 -3,1.25; 4 -3,0.75; 5 -3,0.25; 6 -3,-0.25; 7 -3,-0.75; 8 -3,-1.25; 9 -3,-1.75; 10 -3,-2.25; 21 3,-2.25; 22 3,-1.75; 23 3,-1.25; 24 3,-0.75; 25 3,-0.25; 26 3,0.25; 27 3,0.75; 28 3,1.25; 29 3,1.75; 30 3,2.25 | smd 0.28 x 0.85: 11 -2.25,-3; 12 -1.75,-3; 13 -1.25,-3; 14 -0.75,-3; 15 -0.25,-3; 16 0.25,-3; 17 0.75,-3; 18 1.25,-3; 19 1.75,-3; 20 2.25,-3; 31 2.25,3; 32 1.75,3; 33 1.25,3; 34 0.75,3; 35 0.25,3; 36 -0.25,3; 37 -0.75,3; 38 -1.25,3; 39 -1.75,3; 40 -2.25,3 | smd 2.7 x 3.5: P$2 0,0 | smd 1 x 1.5: P$11 -0.65,0.9; P$12 0.65,0.9; P$13 0.65,-0.9; THERMAL -0.65,-0.9 | drill 0.4 pad 0.406: VIA1 0,1; VIA2 -1,0; VIA3 0,0; VIA4 1,0; VIA5 0,-1
POGO = smd 3.175 x 3.175: 1 0,0 | drill 0.5: P$2 0,0
4MM = smd 1.7 x 1.7: IN 0,0 | smd 1 x 0.5: OUT 0,1.9

### Placement (x,y rotation side)
15  93.4,48.8 270 top
+  43,56.3 0 top
BL_PULLUP  94.45,55 0 top
C1  41.5,48.35 90 top
C2  91.55,54.15 90 top
C3  34.4,48.35 270 top
LED1  24.65,28.5 270 top
LED2  46.7,28.5 270 top
LED3  61.5,21.65 270 top
LED4  76.7,28.5 270 top
LED5  24.3,14.12 270 top
LED6  46.6,14.12 270 top
LED7  61.1,8.15 270 top
LED8  98.7,28.5 270 top
LED9  76.45,14.12 270 top
LED10  98.65,14.12 270 top
LED11  7.2,28.53 270 top
LED12  26.9,3.87 270 top
LED13  4.85,3.9 270 top
PNP_DOWN  60.05,53.3 270 top
PNP_DOWN1  32.25,51.1 90 top
PNP_UP  56.8,53.3 90 top
Q1  94.5,52.3 180 top
Q2  53.5,53.05 180 top
R11  83.8,48.8 270 top
R12  86.2,48.8 270 top
R13  88.55,48.8 270 top
R14  90.95,48.8 270 top
R16  95.8,48.8 270 top
R17  98.3,48.8 270 top
R18  103.05,48.8 270 top
R19  100.75,48.8 270 top
R20  105.6,48.8 270 top
R_LED0  10.5,42 270 top
R_LED1  13.05,42 270 top
R_LED2  7.7,42 270 top
U$1  36.3,54.25 270 top
U$2  22.9,47.5 270 top
U$3  67.45,45.5 90 top
U$4  55.45,45.5 90 top
U$5  59.45,45.5 90 top
U$6  63.45,45.5 90 top
U$7  51.45,45.5 90 top
U$8  71.45,45.5 0 top
U$9  9.61,32.63 90 top
U$11  20.73,32.63 0 top
U$12  28.14,32.63 0 top
U$13  35.56,32.63 0 top
U$14  42.97,32.63 0 top
U$15  50.38,32.63 0 top
U$16  57.79,32.63 0 top
U$17  65.21,32.63 0 top
U$18  72.67,32.63 0 top
U$19  80.03,32.63 0 top
U$20  87.44,32.63 0 top
U$21  94.86,32.63 0 top
U$22  102.27,32.63 0 top
U$23  113.39,32.63 0 top
U$24  5.91,24.39 0 top
U$25  20.73,24.39 0 top
U$26  28.14,24.39 0 top
U$27  35.56,24.39 0 top
U$28  42.97,24.39 0 top
U$29  50.38,24.39 0 top
U$30  57.79,24.39 0 top
U$31  65.21,24.39 0 top
U$32  72.67,24.39 0 top
U$33  80.03,24.39 0 top
U$34  87.44,24.39 0 top
U$35  94.86,24.39 0 top
U$36  102.27,24.39 0 top
U$37  113.39,24.39 0 top
U$38  13.32,24.39 0 top
U$39  5.91,17.55 0 top
U$40  20.73,17.55 0 top
U$41  28.14,17.55 0 top
U$42  35.56,17.55 0 top
U$43  42.97,17.55 0 top
U$44  50.38,17.55 0 top
U$45  57.79,17.55 0 top
U$46  65.21,17.55 0 top
U$47  72.67,17.55 0 top
U$48  80.03,17.55 0 top
U$49  87.44,17.55 0 top
U$50  94.86,17.55 0 top
U$51  102.27,17.55 0 top
U$52  113.39,17.55 0 top
U$53  24.45,54.6 0 top
U$54  5.91,10.71 0 top
U$55  20.73,10.71 0 top
U$56  28.14,10.71 0 top
U$57  35.56,10.71 0 top
U$58  42.97,10.71 0 top
U$59  50.38,10.71 0 top
U$60  57.79,10.71 0 top
U$61  65.21,10.71 0 top
U$62  72.67,10.71 0 top
U$63  80.03,10.71 0 top
U$64  87.44,10.71 0 top
U$65  94.86,10.71 0 top
U$66  102.27,10.71 0 top
U$67  113.39,7.3 0 top
U$68  13.32,10.71 0 top
U$69  9.61,3.87 0 top
U$70  20.73,3.87 0 top
U$71  26.85,54.6 0 top
U$72  31.85,3.87 0 top
U$73  44.2,3.87 0 top
U$74  29.3,54.55 0 top
U$75  54.09,3.87 0 top
U$76  63.97,3.87 0 top
U$77  76.33,3.87 0 top
U$78  108.2,49.65 0 top
U$79  87.44,3.87 0 top
U$80  108.1,53.4 0 top
U$81  98.56,3.87 0 top
VOLTAGE_REGULATOR  37.9,48.6 180 top

### Tracks (layer width: path | path; a pad name or v marks a point on that pad's centre or on a via)
+3V3  (via drill 0.5)
  Top 0.254: PNP_UP.1 56.85,52.25 | C1.1 41.55,47.55
  Top 0.406: 47.17,54.27 45.15,56.3 +.P$1
  Top 0.813: C1.1 VOLTAGE_REGULATOR.3 37.9,44.9 v37.1,44.1 | v13.05,44.1 13.05,42.95 | 13.05,42.95 12.7,42.85 R_LED0.1 R_LED2.1 | R_LED1.1 13.05,42.95 | C2.2 BL_PULLUP.1 93.55,55 Q1.2
  Top 1.016: C2.2 64.15,55 | 41.55,47.55 43.75,47.55 46.45,50.25 46.45,53.55 47.17,54.27 50.4,57.5 61.65,57.5 64.15,55 | 57.5,50.2 55.45,48.15 U$4.P$2 | 57.5,50.2 62.05,50.2 64.15,52.3 64.15,55 | 56.85,52.25 57.5,50.2
  Bottom 0.813: v37.1,44.1 v13.05,44.1
BACKLIGHT  (via drill 0.5)
  Top 0.254: v20.45,55.7 21.15,55 U$2.9 | Q1.1 95.3,53.3 BL_PULLUP.2 v97.55,55
  Bottom 0.254: v20.45,55.7 58.15,55.7 58.9,54.95 v97.55,55
COL0  (via drill 0.4)
  Top 0.254: v113.4,33 arc-183 U$23.IN | U$22.IN 102.1,32.8 v102.1,33 | U$21.IN 94.75,32.74 v94.75,33 | U$20.IN 87.1,32.97 v87.1,33 | U$19.IN 79.85,32.81 v79.85,33 | U$18.IN 72.75,32.71 v72.75,33 | U$17.IN 64.84,33 v65.2,33 | U$16.IN 57.42,33 v57.8,33 | U$15.IN 50.55,32.8 v50.55,33 | U$14.IN 43.15,32.81 v43.15,33 | U$13.IN 35.8,32.87 v35.8,33 | U$12.IN 27.85,32.92 v27.85,33 | U$11.IN 20.85,32.75 | 20.85,32.75 20.85,33 | 20.85,32.75 20.95,32.85 v20.95,33 | U$2.29 24.65,42 v25.7,40.95
  Top 0.406: U$9.IN v9.6,33
  Bottom 0.254: v9.6,33 v20.95,33 25.8,33 | 25.8,33 v27.85,33 v35.8,33 v43.15,33 v50.55,33 v57.8,33 | v57.8,33 v65.2,33 v72.75,33 v79.85,33 v87.1,33 v94.75,33 v102.1,33 v113.4,33 | v57.8,33 57.55,33 | v25.7,40.95 25.7,33.1 25.8,33
COL1  (via drill 0.4)
  Top 0.254: U$24.IN v5.9,24.8 | v113.4,24.8 U$37.IN | U$38.IN arc-90 13.3,24.41 v13.3,24.8 | U$25.IN arc90 20.8,24.46 v20.8,24.8 | U$26.IN arc90 28.45,24.7 v28.15,24.8 | U$27.IN arc90 35.7,24.53 v35.7,24.8 | U$28.IN arc-90 42.95,24.41 42.95,24.8 v42.9,24.8 | U$29.IN arc-90 50.15,24.62 v50.15,24.8 | U$30.IN arc90 57.85,24.45 v57.85,24.8 | U$31.IN arc90 65.3,24.48 v65.3,24.8 | U$32.IN arc90 72.7,24.42 v72.7,24.8 | U$33.IN arc-90 79.9,24.52 v79.9,24.8 | U$34.IN arc-90 87.15,24.68 v87.45,24.8 | U$35.IN arc90 94.95,24.48 v94.95,24.8 | U$36.IN arc-90 102.2,24.46 v102.2,24.8 | U$2.30 25.15,43.25 v25.85,42.55 | v31.5,34.65 31.5,30.15 v29.75,28.4
  Bottom 0.254: v5.9,24.8 v13.3,24.8 v20.8,24.8 v28.15,24.8 29.75,24.8 | 29.75,24.8 v35.7,24.8 v42.9,24.8 v50.15,24.8 v57.85,24.8 v65.3,24.8 v72.7,24.8 v79.9,24.8 v87.45,24.8 v94.95,24.8 v102.2,24.8 v113.4,24.8 | v25.85,42.55 31.5,36.9 v31.5,34.65 | v29.75,28.4 29.75,24.8
COL2  (via drill 0.4, 0.5)
  Top 0.254: U$39.IN v5.9,18.05 | v113.4,18.05 U$52.IN | U$51.IN 102.27,18.03 v102.25,18.05 | U$50.IN v94.86,18.04 v94.85,18.05 | U$49.IN v87.44,18.04 v87.45,18.05 | U$48.IN 80.03,18.03 v80.05,18.05 | U$47.IN 72.67,18.03 v72.65,18.05 | U$46.IN v65.21,18.04 v65.2,18.05 | U$45.IN v57.79,18.04 v57.8,18.05 | U$44.IN 50.38,18.02 v50.35,18.05 | U$43.IN 42.97,18.03 v42.95,18.05 | U$42.IN v35.56,18.04 v35.55,18.05 | U$41.IN 28.14,17.94 v28.15,18.05 | U$40.IN 20.63,17.83 v20.75,18.05 | U$2.31 25.9,44.2 v28.5,41.6 | v38.45,19.7 38.75,20 38.75,34.7 v38.3,35.15
  Bottom 0.254: v5.9,18.05 v20.75,18.05 v28.15,18.05 v35.55,18.05 38.55,18.05 | 38.55,18.05 v42.95,18.05 v50.35,18.05 v57.8,18.05 v65.2,18.05 v72.65,18.05 v80.05,18.05 v87.45,18.05 v94.85,18.05 v102.25,18.05 v113.4,18.05 | v38.45,19.7 38.45,18.15 38.55,18.05 | v28.5,41.6 34.95,35.15 v38.3,35.15
COL3  (via drill 0.4, 0.5)
  Top 0.254: U$54.IN v5.9,11.2 | v102.3,11.2 102.27,11.25 U$66.IN | U$55.IN 20.75,10.71 v20.75,11.2 | U$56.IN 28.1,10.71 v28.1,11.2 | U$57.IN 35.7,10.71 v35.7,11.2 | U$58.IN 43,10.71 v43,11.2 | U$59.IN 50.15,10.71 v50.35,11.2 | U$60.IN 57.9,10.71 v57.9,11.2 | U$61.IN v65.2,11.2 | U$62.IN 72.7,10.71 v72.7,11.2 | U$63.IN 80,10.71 v80,11.2 | U$64.IN 87.4,10.71 v87.4,11.2 | U$65.IN v94.85,11.2 | U$68.IN v13.3,10.95 | U$2.32 26.85,45.75 v30.75,41.85 | v40.45,35 39.75,34.3 39.75,12.5 v39.95,12.3
  Bottom 0.254: v5.9,11.2 13.3,11.2 | 13.3,11.2 v20.75,11.2 v28.1,11.2 v35.7,11.2 v43,11.2 39.95,11.15 | 39.95,11.15 v50.35,11.2 v57.9,11.2 v65.2,11.2 v72.7,11.2 v80,11.2 v87.4,11.2 v94.85,11.2 v102.3,11.2 | v13.3,10.95 13.3,11.2 | v30.75,41.85 36.15,36.45 39,36.45 v40.45,35 | v39.95,12.3 39.95,11.15
COL4  (via drill 0.4, 0.5)
  Top 0.254: U$69.IN arc-90 U$69.IN v9.6,4.35 | v98.55,4.35 v98.56,4.35 U$81.IN | U$67.IN 113.4,7.25 v113.4,7.7 | U$79.IN 87.4,3.91 v87.4,4.35 | U$77.IN 76.3,3.9 v76.3,4.35 | U$76.IN 64.1,4 v64.1,4.35 | U$75.IN 53.95,4.01 v54.15,4.35 | U$73.IN 44,4.07 v44.2,4.35 | U$72.IN 31.65,4.07 v31.85,4.35 | U$70.IN 20.65,3.95 v20.65,4.35 | U$2.33 29.4,46.25 v33.65,42 | v53.85,34.15 53.85,9.55 v57.3,6.1
  Bottom 0.254: v9.6,4.35 v20.65,4.35 v31.85,4.35 | 57.4,4.35 v54.15,4.35 v44.2,4.35 44.2,7.85 42.65,9.4 32.95,9.4 31.85,8.3 v31.85,4.35 | 57.4,4.35 v64.1,4.35 64.1,7.8 65.85,9.55 74.6,9.55 76.3,7.85 v76.3,4.35 87.35,4.3 v87.4,4.35 87.4,8.2 88.85,9.65 97.2,9.65 98.55,8.3 v98.55,4.35 110.05,4.35 v113.4,7.7 | v31.85,4.35 31.8,4.35 | v33.65,42 37.45,38.2 49.85,38.2 v53.85,34.15 | v57.3,6.1 57.3,4.45 57.4,4.35
DRAIN
  Top 0.61: R20.1 U$78.P$1
  Top 0.813: Q1.3 94.5,49.75 94.6,49.65
  Top 1.016: R11.1 R12.1 R13.1 R14.1 15.1 94.6,49.65 R16.1 R17.1 R19.1 R18.1 R20.1
GND  (via drill 0.5)
  Top 0.406: U$2.VIA5 21.9,48.15 U$2.THERMAL
  other vias: 3.2,39.7 119.6,41.1 120.75,1.4 2.1,1.45 16.5,47.85 106.9,21.75 74.3,47.3 73.55,52.95 79.25,58 114.65,58.55 8.25,58.6 96.6,51.2 96.75,53.2 92.65,51.1 73.8,57.95
  pour Top: 0,0 35.09,0 arc90 36.5,1.41 36.5,4 34.05,6.45 34.05,7.5 41.5,7.5 41.5,6.5 39,4 39,1.5 arc90 40.5,0 66.9,0 arc90 68.5,1.6 68.5,4 66.05,6.5 66.15,7.45 73.5,7.5 73.5,6.5 71,4 70.97,1.56 arc91 72.51,0 90.35,0 arc90 91.85,1.5 91.85,4.05 89.4,6.5 89.4,7.45 96.85,7.45 96.85,6.55 94.35,4.05 94.35,1.35 arc90 95.75,-0.05 123,0 123,2 arc90 122,3 120.05,3 arc-90 119,4.05 119,6 arc-90 120,7 122,7 arc90 123,8 123,45.3 119.72,45.27 arc-90 113.55,51.42 113.55,51.55 arc-90 119.75,57.75 119.85,57.75 123,57.7 123,61 110.8,61 76.45,61 59.55,61 0,61 0,57.74 3.29,57.74 3.25,57.75 arc-90 9.45,51.55 9.45,51.34 arc-90 3.36,45.24 0,45.3 0,8 arc90 1,7 3,7 arc-90 4.05,5.95 4.05,4.05 arc-90 3,3 1,3 arc90 0,2
  pour Bottom (rank 3): 0,0 35.09,0 arc90 36.5,1.41 36.5,4 34,6.5 34,7.5 41.5,7.5 41.5,6.5 39,4 39,1.55 arc90 40.55,0 66.99,0 arc90 68.5,1.51 68.5,4 66.05,6.5 66.1,7.5 73.5,7.45 73.5,6.5 71,4 70.97,1.58 arc91 72.53,0 90.25,0 arc90 91.85,1.6 91.85,4 89.4,6.45 89.4,7.5 96.85,7.5 96.85,6.55 94.35,4.05 94.35,1.46 arc90 95.86,-0.05 123,0 123,2 arc90 122,3 120.2,3 arc-90 119,4.2 119,6 arc-90 120,7 122,7 arc90 123,8 123,45.3 119.75,45.25 arc-180 119.75,57.75 123,57.75 123,61 109.5,61 75.85,61 0,61 0,57.75 3.25,57.75 arc-178 3.45,45.25 3.38,45.24 0,45.3 0,8 arc90 1,7 3,7 arc-90 4.05,5.95 4.05,4.05 arc-90 3,3 1,3 arc90 0,2
INT18  (via drill 0.5)
  Top 0.254: v15.8,50.1 16.65,49.25 U$2.12 | v49.25,50.9 51.45,50.9 51.45,53.05 Q2.2
  Top 0.305: 51.45,50.9 U$7.P$2
  Bottom 0.254: v15.8,50.1 25.3,50.1 27.25,52.05 48.1,52.05 v49.25,50.9
LED_GROUND0
  Top 0.254: R_LED0.2 10.5,38.1 4.85,32.45 4.85,29.55 6.52,27.88 LED11.2
LED_GROUND1  (via drill 0.5)
  Top 0.254: R_LED1.2 13.05,38.9 v13.45,38.5 | LED12.2 26.87,3.25 25.8,3.25 22.6,6.45 22.6,7.85 23.9,9.15 23.9,12.05 22.75,13.2 22.75,15.15 23.95,16.3 23.95,25.7 22.45,27.2 22.45,29.7 23.9,31.15 23.9,33.9 v24.2,34.2
  Bottom 0.254: v13.45,38.5 17.75,34.2 v24.2,34.2
LED_GROUND2
  Top 0.254: LED13.2 5,3.25 5.65,3.9 5.65,6.15 3.85,7.95 2.55,7.95 1.9,8.6 1.9,33.05 7.7,38.85 R_LED2.2
N$1  (via drill 0.5)
  Top 0.254: R11.2 82.3,46.45 v80,46.45 | v61.45,34.05 v61.45,31.6 | v25.9,27.8 LED1.2
  Bottom 0.254: v61.45,31.6 29.7,31.6 v25.9,27.8 | v61.45,34.05 62.9,35.5 69.05,35.5 v80,46.45
N$2  (via drill 0.5)
  Top 0.254: R12.2 83.05,44.8 v81.55,44.8 | v68.85,34.25 68.85,31.85 v68.7,31.7 | v45.1,28.8 45.6,27.8 LED2.2
  Bottom 0.254: v68.7,31.7 67.4,30.4 46.6,30.4 v45.1,28.8 | v81.55,44.8 71,34.25 v68.85,34.25
N$3  (via drill 0.5)
  Top 0.254: R13.2 83.1,42.5 v82.4,42.5 | v74.1,28.6 74.1,29.55 76,31.45 76,33.65 v75.05,34.6 | v63.25,28.05 61.95,26.75 61.95,23.3 62.3,22.95 62.3,21.4 61.9,21 LED3.2
  Bottom 0.254: v74.1,28.6 63.8,28.6 v63.25,28.05 | v75.05,34.6 75.05,35.15 v82.4,42.5
N$4  (via drill 0.5)
  Top 0.254: R14.2 88.1,45.1 v88.1,45.05 | v76.95,34.35 76.95,30.85 77.75,30.05 77.75,28.55 77.2,27.9 76.7,27.9 LED4.2
  Bottom 0.254: v88.1,45.05 83.8,40.75 v76.95,34.35
N$6  (via drill 0.5)
  Top 0.254: v90.95,16.55 v90.95,34.3 | v90.75,44.85 93.4,47.5 15.2 | v25.55,14.2 25,13.65 LED5.2
  Bottom 0.254: v25.55,14.2 27.45,16.2 90.6,16.2 v90.95,16.55 | v90.95,34.3 90.95,44.65 v90.75,44.85
N$7  (via drill 0.5)
  Top 0.254: LED6.2 47.2,13.5 v48.15,14.4 | v93.65,44.8 95.8,46.95 R16.2 | v100.3,14.35 100.3,15.7 99.55,16.45 99.55,18.75 100.9,20.1 100.9,21.85 99.6,23.15 99.6,25.65 100.9,26.95 100.9,30.05 99.2,31.7 99.2,34.4 v99.55,34.7
  Bottom 0.254: v48.15,14.4 48.75,15 93.15,15 94.15,16 98.65,16 v100.3,14.35 | v93.65,44.8 93.65,36.05 95.75,33.9 98.65,33.9 v99.55,34.7
N$8  (via drill 0.5)
  Top 0.254: v117.8,13 117.8,36.6 v111.1,43.3 | v98.3,44.7 R17.2 | LED7.2 61.25,7.55 61.95,8.1 61.95,12.5 v63.1,13.65
  Bottom 0.254: v63.1,13.65 63.75,13 v117.8,13 | v111.1,43.3 109.7,44.7 v98.3,44.7
N$9  (via drill 0.6)
  Top 0.254: R18.2 103.05,44.3 108.55,38.8 108.55,28.05 v107.95,27.45 | v98.7,26.85 LED8.2
  Bottom 0.254: v107.95,27.45 99.3,27.45 v98.7,26.85
N$10  (via drill 0.5)
  Top 0.254: R19.2 100.75,43.95 v102.05,42.65 | v78.2,14.05 77.55,13.4 LED9.2 | v98,35 98,31.6 96.15,29.75 96.15,27.2 97.75,25.6 97.75,23.15 96.35,21.75 96.35,20.3 97.6,19.05 97.6,16.45 96.45,15.3 96.45,14.45 96.25,14.25 v95.95,14.25
  Bottom 0.254: v102.05,42.65 102.05,39.2 v98,35 | v95.95,14.25 78.4,14.25 v78.2,14.05
N$11  (via drill 0.6)
  Top 0.254: R20.2 105.6,45.15 109.9,40.85 109.9,11.85 v109.05,11 | v101,6.95 98.65,9.3 LED10.2
  Bottom 0.254: v109.05,11 105,6.95 v101,6.95
N$13
  Top 0.406: Q2.1 PNP_UP.2 PNP_DOWN.1
N$14  (via drill 0.5)
  Top 0.254: 22.07,56.58 21.3,57.35 18.75,57.35 14.35,52.95 14.35,48.7 15.2,47.85 v15.2,42.35 | 22.07,56.58 22.15,56.5 U$2.7 | v18.25,36.25 15.25,33.25 15.25,27.65 16.75,26.15 16.75,20.85 16.7,18.75 16.7,8.7 v18.1,7.3 | 26.93,4.55 LED12.1 26.9,5.45 v28,6.55 | U$71.P$1 26.85,54.95 25.2,56.6 25.2,57.65 24.65,58.2 23.7,58.2 22.07,56.58
  Bottom 0.254: v15.2,42.35 18.25,39.3 v18.25,36.25 | v18.1,7.3 27.25,7.3 v28,6.55
N$15  (via drill 0.5, 0.6)
  Top 0.254: U$2.6 22.65,54.4 | 22.65,54.4 22.65,55.7 v24.25,57.3 | U$53.P$1 24.25,54.4 22.65,54.4 | v6.05,31.3 7.2,30.15 LED11.1
  Bottom 0.254: v24.25,57.3 23.1,58.45 17.2,58.45 12.55,53.8 12.55,48.9 10.3,46.65 10.3,37.65 6.05,33.4 v6.05,31.3
N$16  (via drill 0.5)
  Top 0.254: v13.15,46.75 10.95,44.55 6.65,44.55 5,42.9 5,36.8 1.45,33.25 1.45,8.25 2.2,7.5 3.7,7.5 4.85,6.35 LED13.1 | v18.75,55.95 19.7,56.9 21.1,56.9 21.65,56.35 U$2.8 | U$74.P$1 29.25,54.5 29.25,52.65 28.8,52.2 v25.55,52.2
  Bottom 0.254: v13.15,46.75 14,47.6 14,51.55 15.28,52.83 | 15.28,52.83 18.4,55.95 v18.75,55.95 | v25.55,52.2 25,51.65 16.6,51.65 15.43,52.83 15.28,52.83
N$17
  Top 0.254: PNP_DOWN1.2 32.55,52.25 32.55,54.25 33.3,55 U$1.1
ROW0
  Top 0.254: U$69.OUT 6.8,8.58 6.8,8.9 7.75,9.85 7.75,11.65 6.79,12.61 U$54.OUT 5.9,15.65 5.85,15.65 arc-90 4,17.5 4,17.54 arc-90 U$39.OUT 5.9,22.45 5.85,22.45 arc-90 3.9,24.4 arc-94 U$24.OUT 8.84,26.29 9.5,26.95 9.5,30.4 9.15,30.75 8.7,30.75 7.71,31.74 U$9.OUT 7.71,33.46 8.85,34.6 13.75,34.6 17.2,38.05 17.2,46.3 18.65,47.75 U$2.15
ROW1
  Top 0.254: U$68.OUT 13.3,12.41 13.3,22.45 13.1,22.45 arc-90 11.35,24.2 11.35,24.32 arc-90 U$38.OUT 13.32,33.47 17.65,37.8 17.65,46.1 18.8,47.25 U$2.16
ROW2
  Top 0.254: U$70.OUT 20.73,8.73 arc-90 20.75,8.75 20.65,8.75 arc-90 18.75,10.65 arc-91 U$55.OUT arc-90 20.7,12.64 20.7,15.7 arc-90 18.7,17.7 18.7,17.95 arc-90 20.2,19.45 U$40.OUT arc-90 20.65,19.53 20.65,22.45 arc-90 18.75,24.35 18.75,24.65 arc-90 20.39,26.29 U$25.OUT arc-90 20.7,26.32 20.7,30.65 arc-90 18.85,32.5 18.85,33.1 arc-90 20.28,34.53 U$11.OUT 20.73,37.32 18.1,39.95 18.1,45.95 18.9,46.75 U$2.17
ROW3
  Top 0.254: U$72.OUT 28.95,8.67 28.95,8.95 29.9,9.9 29.9,11.9 29.19,12.61 U$56.OUT arc-90 28.1,12.65 28.1,15.6 arc-90 26.2,17.5 26.2,17.8 arc-90 27.85,19.45 U$41.OUT arc-90 28.1,19.49 28.1,22.5 arc-90 26.15,24.45 26.15,24.55 arc-90 27.89,26.29 U$26.OUT arc-90 28.1,26.33 28.1,30.75 arc-90 26.25,32.6 26.25,32.75 arc-90 28.03,34.53 U$12.OUT 27.27,35.4 23.4,35.4 18.6,40.2 18.6,45.8 19.05,46.25 U$2.18
ROW4
  Top 0.254: U$57.OUT 35.55,15.65 arc-90 33.65,17.55 33.65,17.7 arc-90 35.4,19.45 U$42.OUT 35.56,22.44 35.5,22.5 arc-90 33.6,24.4 33.6,24.65 arc-90 35.24,26.29 U$27.OUT arc-90 35.5,26.35 35.5,30.8 arc-90 33.5,32.8 33.5,33.05 arc-90 34.98,34.53 U$13.OUT 34.24,35.85 23.65,35.85 19.1,40.4 19.1,45.55 19.3,45.75 U$2.19
ROW5
  Top 0.254: U$73.OUT 43,6.97 43,8.75 arc90 44.9,10.65 44.9,10.8 arc90 43.09,12.61 U$58.OUT 42.97,15.85 41.8,15.85 arc-90 41.3,16.35 41.3,18.35 arc-90 42.4,19.45 U$43.OUT arc-90 42.95,19.47 42.95,22.45 arc-90 40.9,24.5 40.9,24.65 arc-90 42.54,26.29 U$28.OUT arc90 43,26.32 43,30.7 arc-90 41,32.7 41,32.8 arc-90 42.73,34.53 U$14.OUT 41.2,36.3 23.9,36.3 19.9,40.3 U$2.20 19.85,45.25
ROW6
  Top 0.254: U$75.OUT 51.65,9.2 52.15,9.7 52.15,11.8 51.34,12.61 U$59.OUT arc90 50.4,12.63 50.4,15.7 50.2,15.7 arc-90 48.35,17.55 arc-94 U$44.OUT arc-90 50.35,19.48 50.35,22.45 arc-90 48.35,24.45 48.35,24.85 arc-90 49.79,26.29 U$29.OUT arc90 50.4,26.31 50.4,30.65 arc-90 48.5,32.55 48.5,32.9 arc-90 50.13,34.53 U$15.OUT 49.51,35.4 42.75,35.4 41.4,36.75 24.1,36.75 20.65,40.2 U$2.21
ROW7
  Top 0.254: U$60.OUT 57.8,15.7 arc-90 55.8,17.7 arc-90 57.55,19.45 U$45.OUT arc-90 57.75,19.49 57.75,22.45 arc-90 55.9,24.3 55.9,24.6 arc-90 57.59,26.29 U$30.OUT arc90 U$30.OUT 57.8,30.65 arc-90 55.9,32.55 55.9,32.85 arc-90 57.58,34.53 U$16.OUT 56.97,35.35 50.2,35.35 49.7,35.85 42.95,35.85 41.6,37.2 24.3,37.2 21.15,40.35 U$2.22
ROW8
  Top 0.254: U$76.OUT 64.25,6.05 64.25,9.1 63.3,10.05 63.3,11.45 64.46,12.61 U$61.OUT arc-90 U$61.OUT 65.2,15.65 65,15.65 arc-90 63.15,17.5 arc-93 U$46.OUT arc-90 U$46.OUT 65.2,22.5 arc-90 63.25,24.45 63.25,24.8 arc-90 64.74,26.29 U$31.OUT arc-90 U$31.OUT 65.2,30.75 arc-90 63.3,32.65 63.3,33.1 arc-90 64.73,34.53 U$17.OUT 64.64,35.1 59.25,35.1 58.55,35.8 50.35,35.8 49.85,36.3 43.1,36.3 41.75,37.65 24.5,37.65 21.65,40.5 U$2.23
ROW9
  Top 0.254: U$2.24 22.15,40.65 24.7,38.1 41.95,38.1 43.3,36.75 50,36.75 50.5,36.25 58.8,36.25 59.5,35.55 69.3,35.55 70.32,34.53 U$18.OUT 72.38,34.53 arc90 70.75,32.9 70.75,32.65 arc90 72.7,30.7 72.7,26.32 arc-90 U$32.OUT 72.96,26.29 arc-90 74.6,24.65 74.6,24.5 arc-90 72.65,22.55 72.65,19.47 arc90 U$47.OUT 73,19.45 arc-90 74.5,17.95 74.5,16.7 arc-90 73.55,15.75 72.67,15.75 U$62.OUT 73.69,12.61 74.45,11.85 74.45,10 73.4,8.95 73.4,8.7 75.15,8.7 76.3,7.55 76.3,5.8 U$77.OUT
ROW10
  Top 0.254: U$63.OUT arc90 80.05,12.63 80.05,15.6 arc-90 78.15,17.5 78.15,17.57 arc-90 U$48.OUT arc90 80.05,19.47 80.05,22.45 arc-90 78.05,24.45 78.05,24.6 arc-90 79.74,26.29 U$33.OUT arc90 80.05,26.31 80.05,30.7 arc-90 78.15,32.6 78.15,32.8 arc-90 79.88,34.53 U$19.OUT | U$2.25 22.65,40.8 24.9,38.55 42.15,38.55 43.5,37.2 50.15,37.2 50.65,36.7 58.95,36.7 59.65,36 69.5,36 70.15,35.35 79.21,35.35 U$19.OUT | 79.5,34.85 79.71,34.85 U$19.OUT
ROW11
  Top 0.254: U$79.OUT 87.44,8.95 86.55,8.95 arc-90 85.6,9.9 85.6,11.25 arc-90 86.96,12.61 U$64.OUT 87.44,15.59 arc-90 87.45,15.6 arc91 89.35,17.55 arc87 U$49.OUT arc90 U$49.OUT 87.45,22.4 arc-90 85.5,24.35 85.5,24.65 arc-90 87.14,26.29 U$34.OUT arc90 U$34.OUT 87.45,30.7 arc-90 85.65,32.5 85.65,33 arc-90 87.18,34.53 U$20.OUT 86.52,35.45 79.75,35.45 79.4,35.8 70.3,35.8 69.65,36.45 59.8,36.45 59.1,37.15 50.8,37.15 50.3,37.65 43.65,37.65 42.3,39 25.1,39 23.15,40.95 U$2.26
ROW12
  Top 0.254: U$2.27 23.65,41.1 25.3,39.45 42.5,39.45 43.85,38.1 50.45,38.1 50.95,37.6 59.25,37.6 60,36.85 69.85,36.85 70.5,36.2 79.6,36.2 79.9,35.9 86.7,35.9 87.15,35.45 93.94,35.45 U$21.OUT 95.12,34.53 arc-90 96.75,32.9 96.75,32.6 arc-90 94.85,30.7 U$35.OUT arc90 U$35.OUT 95.16,26.29 arc-90 96.75,24.7 96.75,24.3 arc-90 94.85,22.4 U$50.OUT arc90 U$50.OUT arc96 92.8,17.6 arc90 94.7,15.7 94.85,15.7 U$65.OUT 95.74,12.61 96.75,11.6 96.75,10 96,9 97.3,9 98.5,7.8 98.5,5.83 U$81.OUT
ROW13
  Top 0.254: U$66.OUT 102.25,15.65 arc-90 100.3,17.6 100.3,17.65 arc-90 102.1,19.45 U$51.OUT arc-90 102.25,19.47 102.25,22.45 arc90 104.15,24.35 104.15,24.8 arc90 102.66,26.29 U$36.OUT arc-90 102.25,26.31 102.25,30.7 arc-90 100.45,32.5 100.45,32.95 arc-90 102.03,34.53 U$22.OUT 100.95,35.85 87.35,35.85 86.85,36.35 80.05,36.35 79.75,36.65 70.65,36.65 70,37.3 60.15,37.3 59.4,38.05 51.1,38.05 50.6,38.55 44,38.55 42.6,39.95 25.45,39.95 24.15,41.25 U$2.28
ROW14  (via drill 0.5)
  Top 0.254: U$23.OUT 114.22,34.53 arc-90 115.2,32.8 115.2,32.5 arc-90 113.4,30.7 U$37.OUT arc-90 U$37.OUT 113.76,26.29 arc-90 115.35,24.7 115.35,24.35 arc-90 113.4,22.4 U$52.OUT arc-90 U$52.OUT 113.9,19.35 arc-90 115.15,18.1 115.4,17.6 arc-90 113.4,15.6 113.4,9.16 arc-90 U$67.OUT 109,9.15 105.1,13.05 105.1,15.85 105.75,16.5 105.75,34.1 103.55,36.3 87.55,36.3 87.05,36.8 80.2,36.8 79.9,37.1 70.85,37.1 70.2,37.75 60.3,37.75 59.55,38.5 51.25,38.5 50.75,39 45.15,39 v41.7,42.45 | U$2.40 27.95,49.75 v28.7,50.5
  Bottom 0.254: v28.7,50.5 34.95,50.5 41.7,43.75 v41.7,42.45
SCL18  (via drill 0.4, 0.5)
  Top 0.254: v18.2,53.65 18.2,50 18.45,49.75 U$2.11 | U$1.6 40.45,54 v40.9,54.55
  Top 0.305: v63.4,47.95 63.4,45.7 U$6.P$2
  Bottom 0.254: v63.4,47.95 56.8,54.55 v40.9,54.55 19.1,54.55 v18.2,53.65
  Bottom 0.305: 63.4,45.7 U$6.P$2
SDA18  (via drill 0.4, 0.5)
  Top 0.254: v19.9,53.25 20.65,52.5 U$2.10 | U$1.5 38,53.45 v43.75,53.45
  Top 0.305: v59.4,47.9 59.4,45.7 U$5.P$2
  Bottom 0.254: v43.75,53.45 53.85,53.45 v59.4,47.9 | v43.75,53.45 43,53.45 | v19.9,53.25 20.1,53.45 v43.75,53.45
  Bottom 0.305: 59.4,45.7 U$5.P$2
VCC
  Top 0.254: 32.23,48.98 32.15,49 | U$1.8 36.55,56.4 31.95,56.4 31.4,55.85 31.4,53.5 30.45,52.55 30.45,49 | PNP_DOWN1.1 32.25,50.27 32.23,50.25 | U$2.39 26.9,49.25 27.15,49 26.9,48.75 U$2.38 | 34.2,49 C3.1
  Top 0.406: 32.23,50.25 32.23,48.98
  Top 0.61: 30.6,49 27.15,49
  Top 0.813: C3.1 34.9,49.7 VOLTAGE_REGULATOR.2 | 34.2,49 32.15,49 30.6,49 30.45,49

### Text on the board
tPlace: R4 | C3 | MOSFET | R1 | R2 | R3
tNames: _ | + | connection / detector | INT | _ | EEPROM | backlight | R5-R14 | C1 | C2 | PNP | + | MCP1700 | 1 | 2 | 3 | 4 | 5 | 6 | 7 | 8 | 9 | 10 | TOHKBD_2.0.6.6 / by Dirk van Leersum | matrix controller | 1 | 4 | 9 | 2 | 3 | 7 | 5 | 6 | 8 | 10